# EAGLE design Controller Board V2.1 (EAGLE 9.6.2)

## Sheet 1 of 7: Fisnar Headers
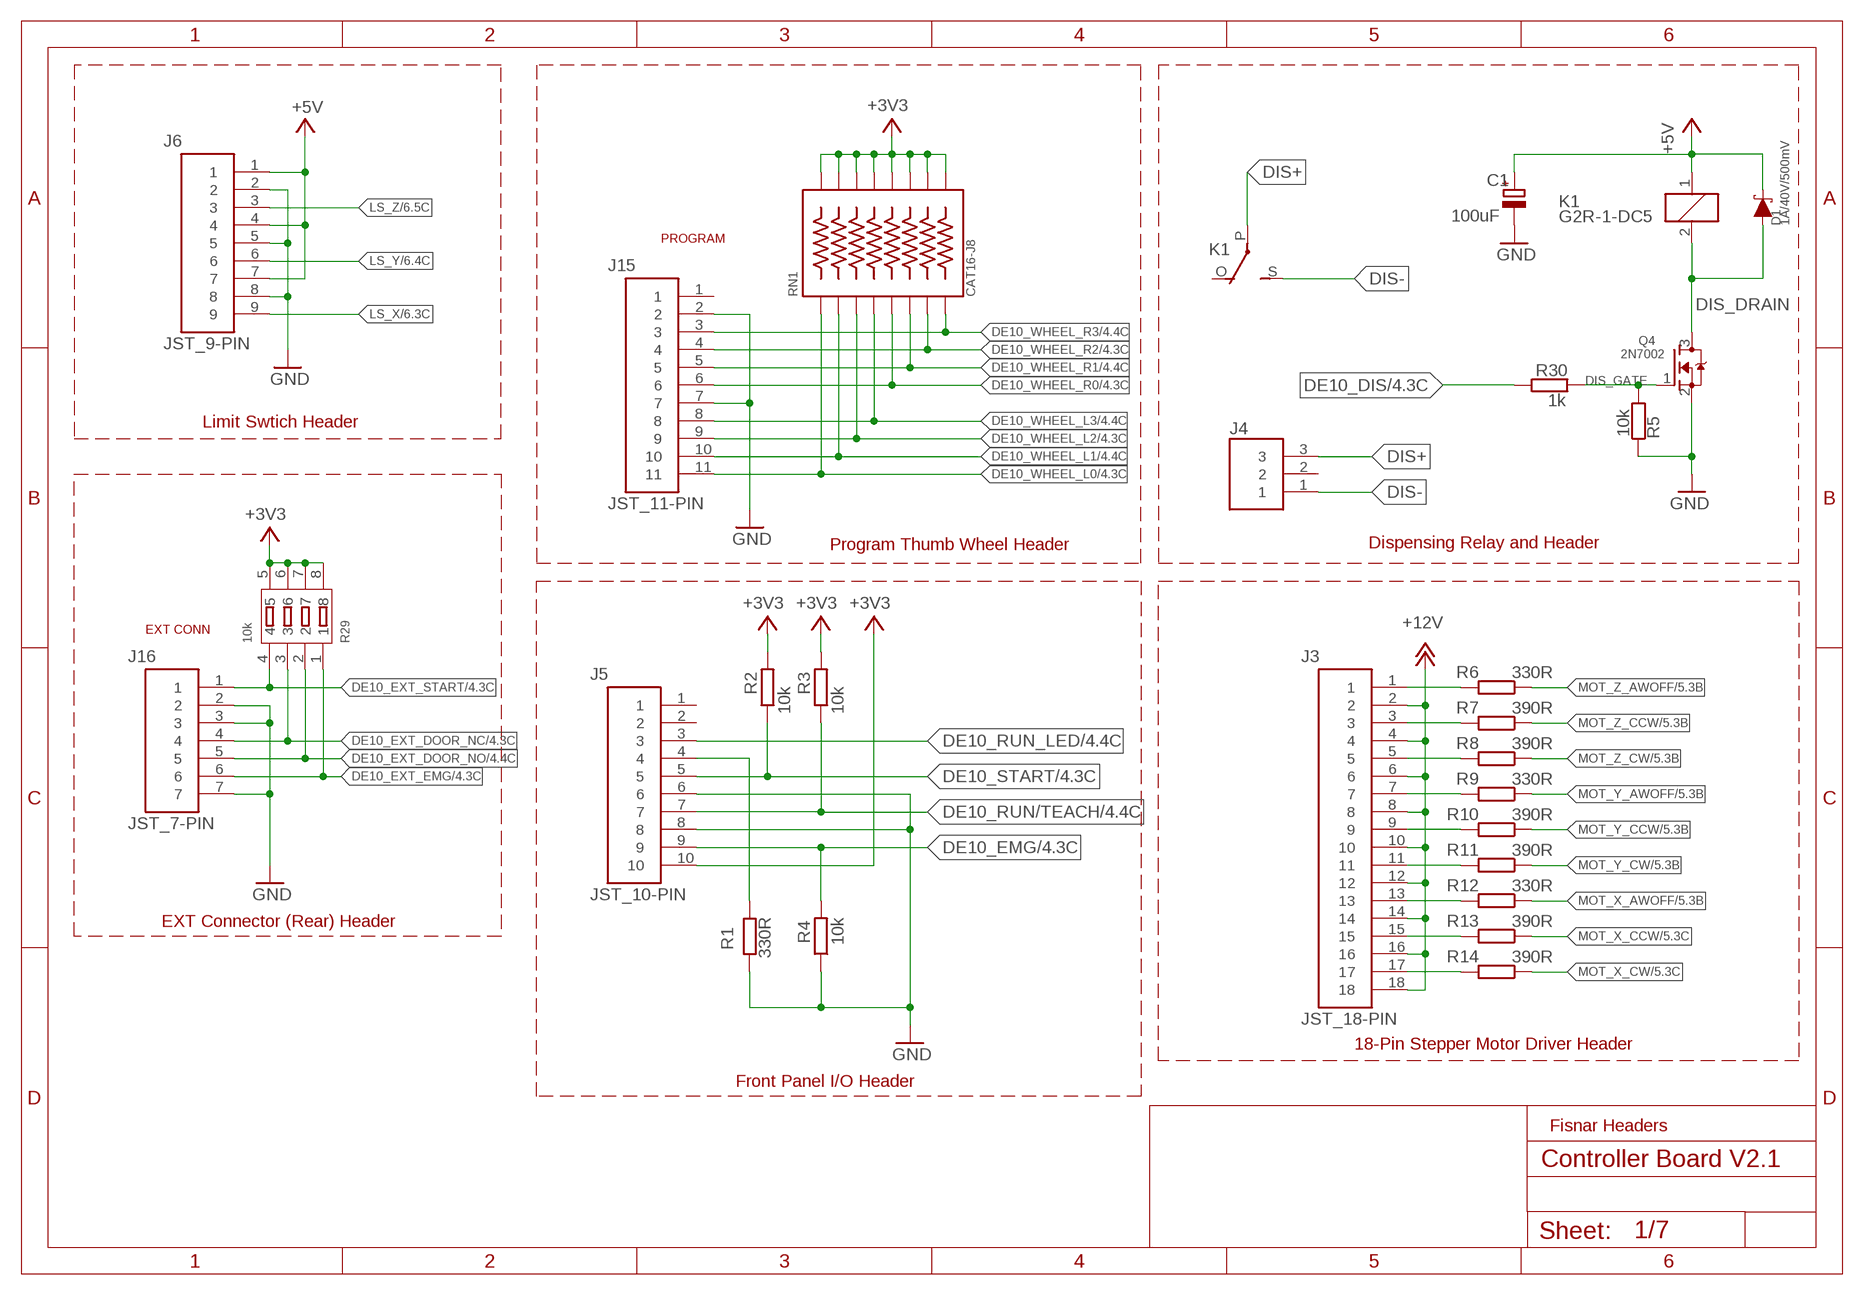
[diagram p0: schematic, sheet 1]

### Parts
C1  100uF  CPOL-EU153CLV-0810  [153CLV-0810]
D1  1A/40V/500mV  DIODE-SCHOTTKY-SS14  [SMA-DIODE]
J3  JST_18-PIN  [JST_18-PIN]
J4  JST_3-PIN  [JST_3-PIN]
J5  JST_10-PIN  [JST_10-PIN]
J6  JST_9-PIN  [JST_9-PIN]
J15  JST_11-PIN  [JST_11-PIN]
J16  JST_7-PIN  [JST_7-PIN]
K1  G2R-1-DC5  G2R  [G2R]
Q4  2N7002  MOSFET-NREFLOW  [SOT23]
R1  330R  R-EU_R0805  [R0805]
R2  10k  R-EU_R0805  [R0805]
R3  10k  R-EU_R0805  [R0805]
R4  10k  R-EU_R0805  [R0805]
R5  10k  R-EU_R0805  [R0805]
R6  330R  R-EU_R0805  [R0805]
R7  390R  R-EU_R0805  [R0805]
R8  390R  R-EU_R0805  [R0805]
R9  330R  R-EU_R0805  [R0805]
R10  390R  R-EU_R0805  [R0805]
R11  390R  R-EU_R0805  [R0805]
R12  330R  R-EU_R0805  [R0805]
R13  390R  R-EU_R0805  [R0805]
R14  390R  R-EU_R0805  [R0805]
R29  10k  SMD-RES-ARRAY-1K-4R(RA1206-8)  [RA1206-8]
R30  1k  R-EU_R0805  [R0805]
RN1  CAT16-J8  [RN8]

### Nets
+3V3: J5.10 R2.2 R3.2 R29.5 R29.6 R29.7 R29.8 RN1.2 RN1.4 RN1.6 RN1.8 RN1.10 RN1.12 RN1.14 RN1.16 ; also sheet 2,3,4,6
+5V: C1.+ D1.C J6.1 J6.4 J6.7 K1.1 ; also sheet 2,3,4,6
+12V: J3.2 J3.4 J3.6 J3.8 J3.10 J3.12 J3.14 J3.16 J3.18 ; also sheet 3,4,5,7
DE10_DIS: R30.2 ; also sheet 4
DE10_EMG: J5.9 R4.2 ; also sheet 4
DE10_EXT_DOOR_NC: J16.4 R29.3 ; also sheet 4
DE10_EXT_DOOR_NO: J16.5 R29.2 ; also sheet 4
DE10_EXT_EMG: J16.6 R29.1 ; also sheet 4
DE10_EXT_START: J16.1 R29.4 ; also sheet 4
DE10_RUN/TEACH: J5.7 R3.1 ; also sheet 4
DE10_RUN_LED: J5.3 ; also sheet 4
DE10_START: J5.5 R2.1 ; also sheet 4
DE10_WHEEL_L0: J15.11 RN1.1 ; also sheet 4
DE10_WHEEL_L1: J15.10 RN1.3 ; also sheet 4
DE10_WHEEL_L2: J15.9 RN1.5 ; also sheet 4
DE10_WHEEL_L3: J15.8 RN1.7 ; also sheet 4
DE10_WHEEL_R0: J15.6 RN1.9 ; also sheet 4
DE10_WHEEL_R1: J15.5 RN1.11 ; also sheet 4
DE10_WHEEL_R2: J15.4 RN1.13 ; also sheet 4
DE10_WHEEL_R3: J15.3 RN1.15 ; also sheet 4
DIS+: J4.3 K1.P(2:P)
DIS-: J4.1 K1.S(2:S)
DIS_DRAIN: D1.A K1.2 Q4.3(D)
DIS_GATE: Q4.1(G) R5.2 R30.1
GND: C1.- J5.6 J5.8 J6.2 J6.5 J6.8 J15.2 J15.7 J16.2 J16.3 J16.7 Q4.2(S) R1.2 R4.1 R5.1 ; also sheet 2,3,4,5,7
LS_X: J6.9 ; also sheet 6
LS_Y: J6.6 ; also sheet 6
LS_Z: J6.3 ; also sheet 6
MOT_X_AWOFF: R12.1 ; also sheet 5
MOT_X_CCW: R13.1 ; also sheet 5
MOT_X_CW: R14.1 ; also sheet 5
MOT_Y_AWOFF: R9.1 ; also sheet 5
MOT_Y_CCW: R10.1 ; also sheet 5
MOT_Y_CW: R11.1 ; also sheet 5
MOT_Z_AWOFF: R6.1 ; also sheet 5
MOT_Z_CCW: R7.1 ; also sheet 5
MOT_Z_CW: R8.1 ; also sheet 5
RUN_LED_RES: J5.4 R1.1
X_AWOFF_NEG: J3.13 R12.2
X_CCW_NEG: J3.15 R13.2
X_CW_NEG: J3.17 R14.2
Y_AWOFF_NEG: J3.7 R9.2
Y_CCW_NEG: J3.9 R10.2
Y_CW_NEG: J3.11 R11.2
Z_AWOFF_NEG: J3.1 R6.2
Z_CCW_NEG: J3.3 R7.2
Z_CW_NEG: J3.5 R8.2
Unconnected: J4.2 J5.1 J5.2 J15.1 K1.O(2:O)

### Notes on the sheet
- PROGRAM
- Limit Swtich Header
- Program Thumb Wheel Header | Dispensing Relay and Header
- EXT CONN
- EXT Connector (Rear) Header
- 18-Pin Stepper Motor Driver Header
- Front Panel I/O Header
- Fisnar Headers

## Sheet 2 of 7: SBC Connectors
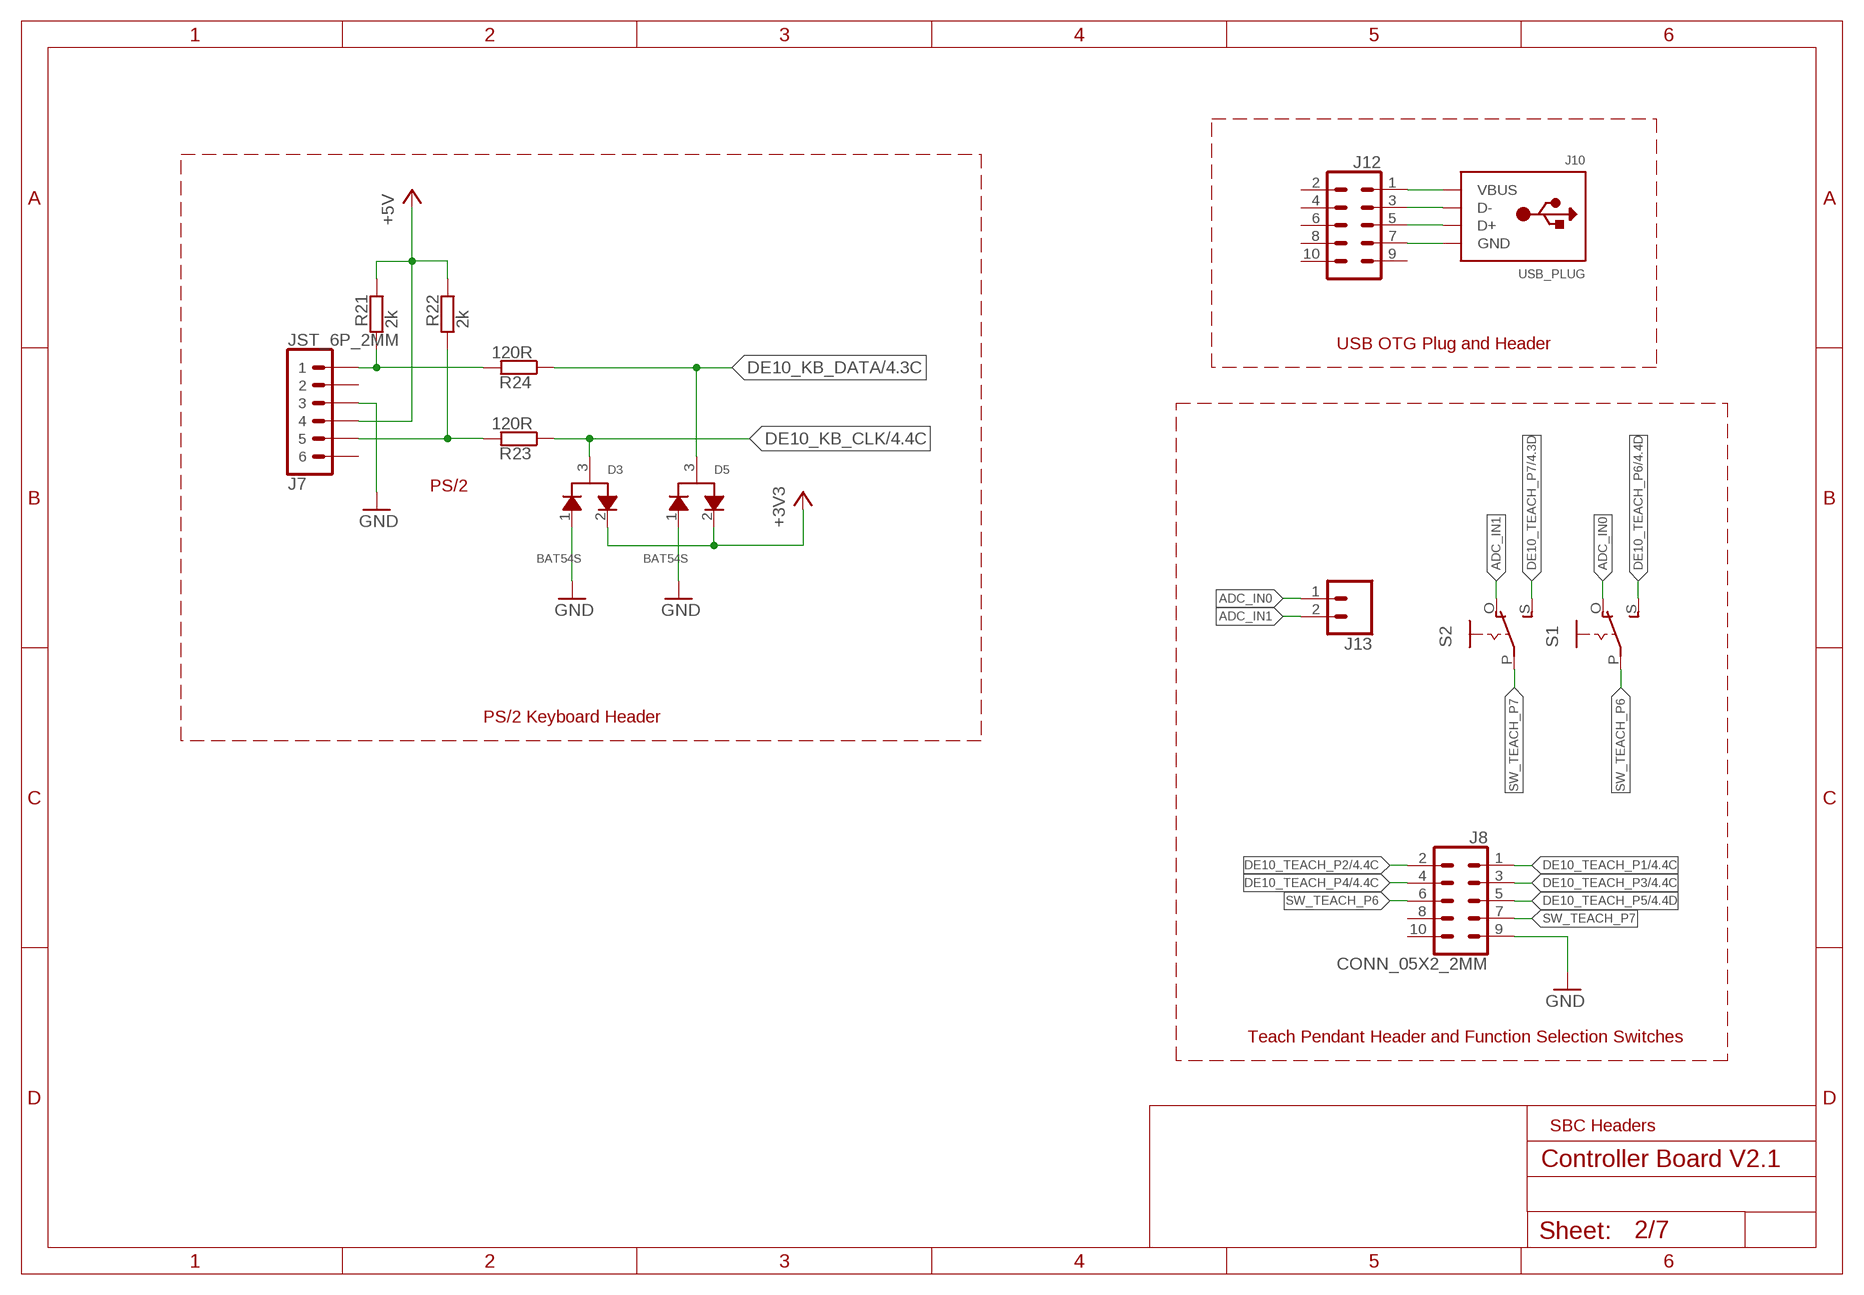
[diagram p1: schematic, sheet 2]

### Parts
D3  BAT54S  [SOT23]
D5  BAT54S  [SOT23]
J7  JST_6P_2MM  [JST_6P_2MM]
J8  CONN_05X2_2MM  [2X5-SHROUDED-2MM]
J10  USB_PLUG  [USB_PLUG]
J12  CONN_05X2PTH  [2X5]
J13  CONN_02  [1X02]
R21  2k  R-EU_R0805  [R0805]
R22  2k  R-EU_R0805  [R0805]
R23  120R  R-EU_R0805  [R0805]
R24  120R  R-EU_R0805  [R0805]
S1  EG1218S  [EG1218]
S2  EG1218S  [EG1218]

### Nets
+3V3: D3.2 D5.2 ; also sheet 1,3,4,6
+5V: J7.P$4 R21.2 R22.2 ; also sheet 1,3,4,6
ADC_IN0: J13.1 S1.O
ADC_IN1: J13.2 S2.O
DE10_KB_CLK: D3.3 R23.1 ; also sheet 4
DE10_KB_DATA: D5.3 R24.1 ; also sheet 4
DE10_TEACH_P1: J8.1 ; also sheet 4
DE10_TEACH_P2: J8.2 ; also sheet 4
DE10_TEACH_P3: J8.3 ; also sheet 4
DE10_TEACH_P4: J8.4 ; also sheet 4
DE10_TEACH_P5: J8.5 ; also sheet 4
DE10_TEACH_P6: S1.S ; also sheet 4
DE10_TEACH_P7: S2.S ; also sheet 4
GND: D3.1 D5.1 J7.P$3 J8.9 ; also sheet 1,3,4,5,7
OTG_D+: J10.D+ J12.5
OTG_D-: J10.D- J12.3
OTG_GND: J10.USB_GND(GND) J12.7
OTG_VBUS: J10.VBUS J12.1
PS2_KB_CLK: J7.P$5 R22.1 R23.2
PS2_KB_DATA: J7.P$1 R21.1 R24.2
SW_TEACH_P6: J8.6 S1.P
SW_TEACH_P7: J8.7 S2.P
Unconnected: J7.P$2 J7.P$6 J8.8 J8.10 J12.2 J12.4 J12.6 J12.8 J12.9 J12.10

### Notes on the sheet
- USB OTG Plug and Header
- PS/2
- PS/2 Keyboard Header
- Teach Pendant Header and Function Selection Switches
- SBC Headers

## Sheet 3 of 7: Rear I/O
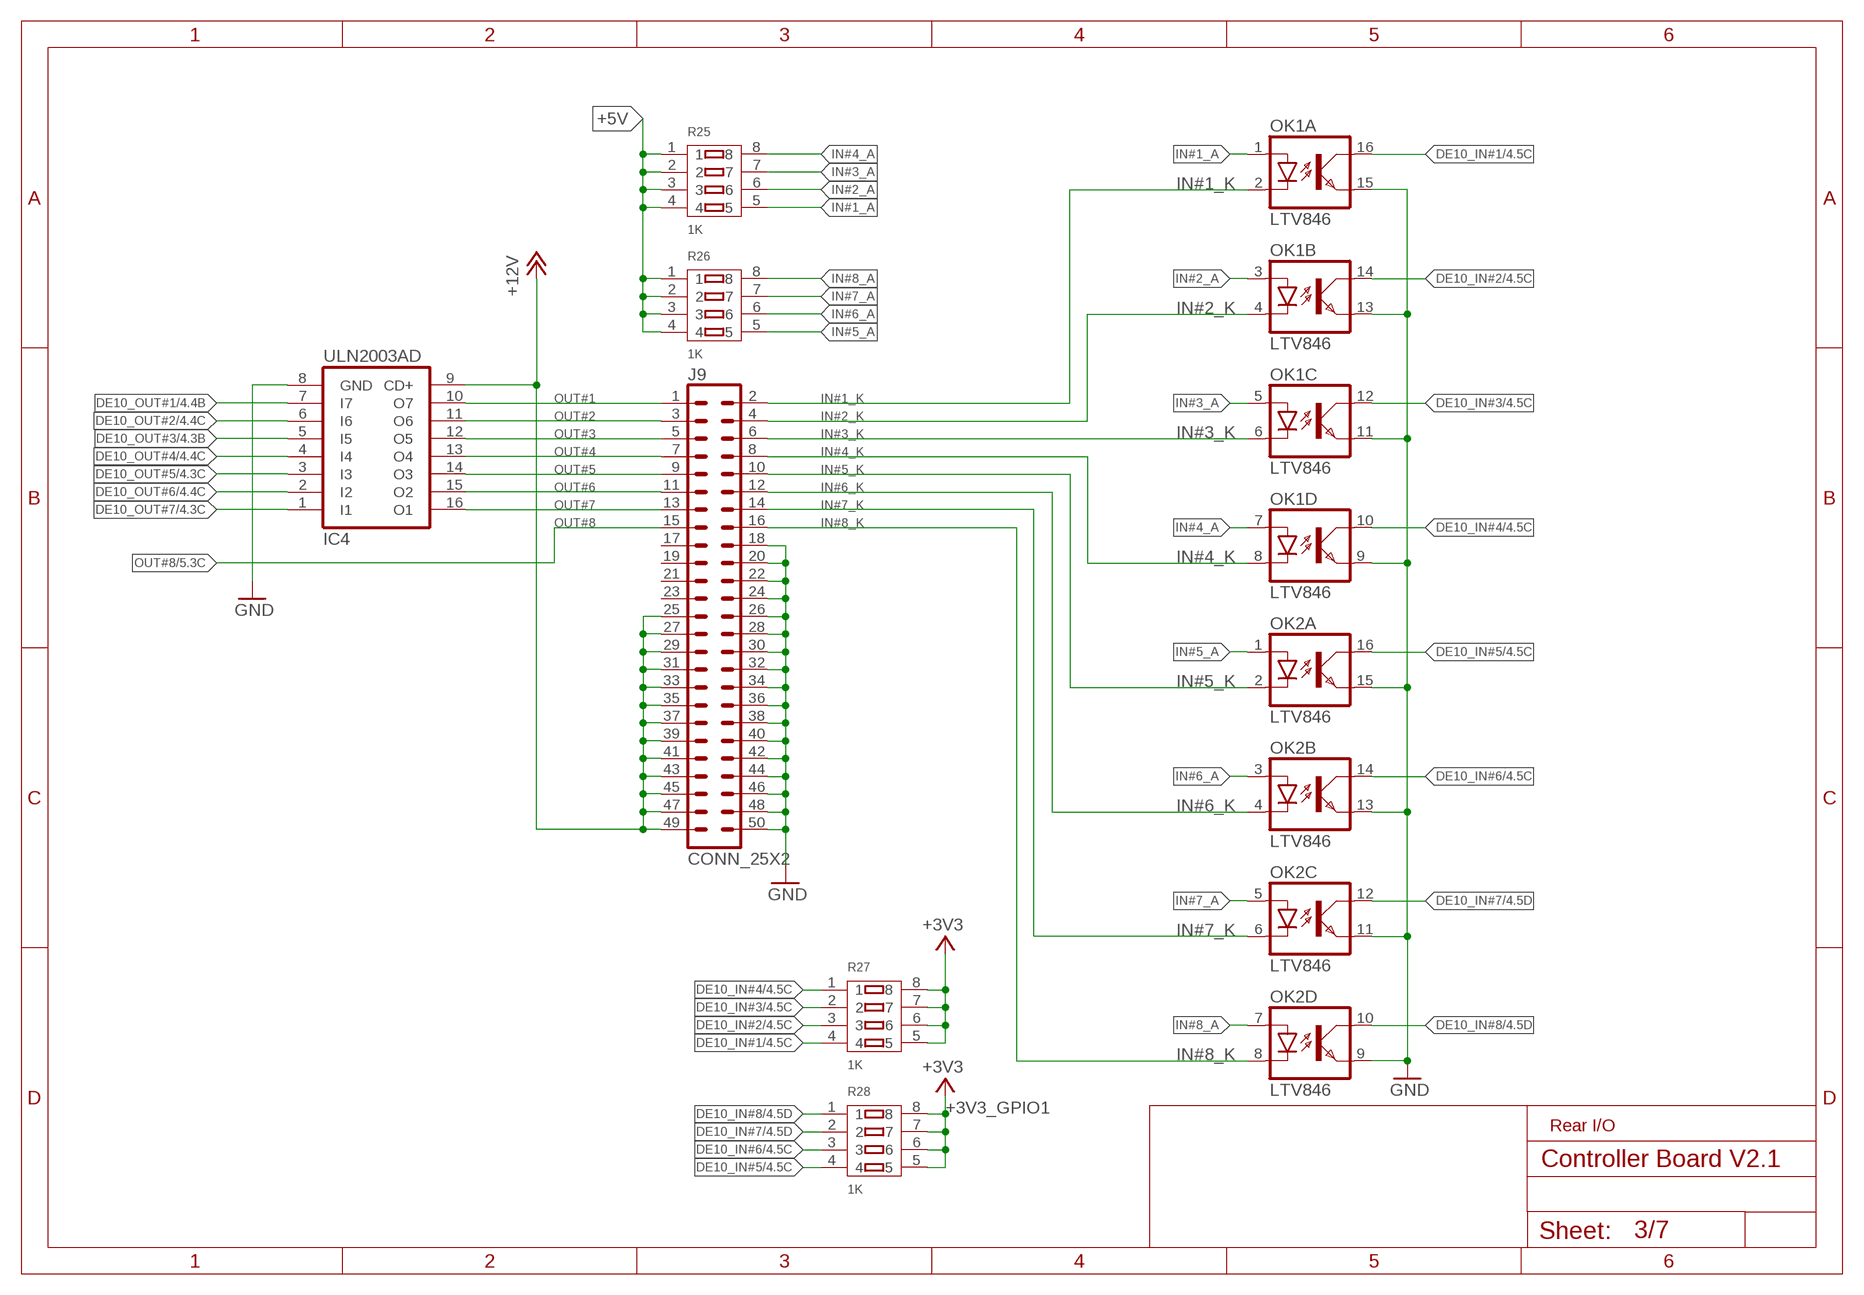
[diagram p2: schematic, sheet 3]

### Parts
IC4  ULN2003AD  [SO16]
J9  CONN_25X2  [2X25]
OK1  LTV846  [DIL8-SMD]
OK2  LTV846  [DIL8-SMD]
R25  1K  SMD-RES-ARRAY-1K-4R(RA1206-8)  [RA1206-8]
R26  1K  SMD-RES-ARRAY-1K-4R(RA1206-8)  [RA1206-8]
R27  1K  SMD-RES-ARRAY-1K-4R(RA1206-8)  [RA1206-8]
R28  1K  SMD-RES-ARRAY-1K-4R(RA1206-8)  [RA1206-8]

### Nets
+3V3: R27.5 R27.6 R27.7 R27.8 ; also sheet 1,2,4,6
+3V3_GPIO1: R28.5 R28.6 R28.7 R28.8 ; supply symbol labelled +3V3 ; also sheet 4,7
+5V: R25.1 R25.2 R25.3 R25.4 R26.1 R26.2 R26.3 R26.4 ; also sheet 1,2,4,6
+12V: IC4.9(CD+) J9.25 J9.27 J9.29 J9.31 J9.33 J9.35 J9.37 J9.39 J9.41 J9.43 J9.45 J9.47 J9.49 ; also sheet 1,4,5,7
DE10_IN#1: OK1.16(A:COL) R27.4 ; also sheet 4
DE10_IN#2: OK1.14(B:COL) R27.3 ; also sheet 4
DE10_IN#3: OK1.12(C:COL) R27.2 ; also sheet 4
DE10_IN#4: OK1.10(D:COL) R27.1 ; also sheet 4
DE10_IN#5: OK2.16(A:COL) R28.4 ; also sheet 4
DE10_IN#6: OK2.14(B:COL) R28.3 ; also sheet 4
DE10_IN#7: OK2.12(C:COL) R28.2 ; also sheet 4
DE10_IN#8: OK2.10(D:COL) R28.1 ; also sheet 4
DE10_OUT#1: IC4.7(I7) ; also sheet 4
DE10_OUT#2: IC4.6(I6) ; also sheet 4
DE10_OUT#3: IC4.5(I5) ; also sheet 4
DE10_OUT#4: IC4.4(I4) ; also sheet 4
DE10_OUT#5: IC4.3(I3) ; also sheet 4
DE10_OUT#6: IC4.2(I2) ; also sheet 4
DE10_OUT#7: IC4.1(I1) ; also sheet 4
GND: IC4.8(GND) J9.18 J9.20 J9.22 J9.24 J9.26 J9.28 J9.30 J9.32 J9.34 J9.36 J9.38 J9.40 J9.42 J9.44 J9.46 J9.48 J9.50 OK1.9(D:EMIT) OK1.11(C:EMIT) OK1.13(B:EMIT) OK1.15(A:EMIT) OK2.9(D:EMIT) OK2.11(C:EMIT) OK2.13(B:EMIT) OK2.15(A:EMIT) ; also sheet 1,2,4,5,7
IN#1_A: OK1.1(A:A) R25.5
IN#1_K: J9.2 OK1.2(A:C)
IN#2_A: OK1.3(B:A) R25.6
IN#2_K: J9.4 OK1.4(B:C)
IN#3_A: OK1.5(C:A) R25.7
IN#3_K: J9.6 OK1.6(C:C)
IN#4_A: OK1.7(D:A) R25.8
IN#4_K: J9.8 OK1.8(D:C)
IN#5_A: OK2.1(A:A) R26.5
IN#5_K: J9.10 OK2.2(A:C)
IN#6_A: OK2.3(B:A) R26.6
IN#6_K: J9.12 OK2.4(B:C)
IN#7_A: OK2.5(C:A) R26.7
IN#7_K: J9.14 OK2.6(C:C)
IN#8_A: OK2.7(D:A) R26.8
IN#8_K: J9.16 OK2.8(D:C)
OUT#1: IC4.10(O7) J9.1
OUT#2: IC4.11(O6) J9.3
OUT#3: IC4.12(O5) J9.5
OUT#4: IC4.13(O4) J9.7
OUT#5: IC4.14(O3) J9.9
OUT#6: IC4.15(O2) J9.11
OUT#7: IC4.16(O1) J9.13
OUT#8: J9.15 ; also sheet 5
Unconnected: J9.17 J9.19 J9.21 J9.23

### Notes on the sheet
- Rear I/O

## Sheet 4 of 7: DE10-Nano Connectors
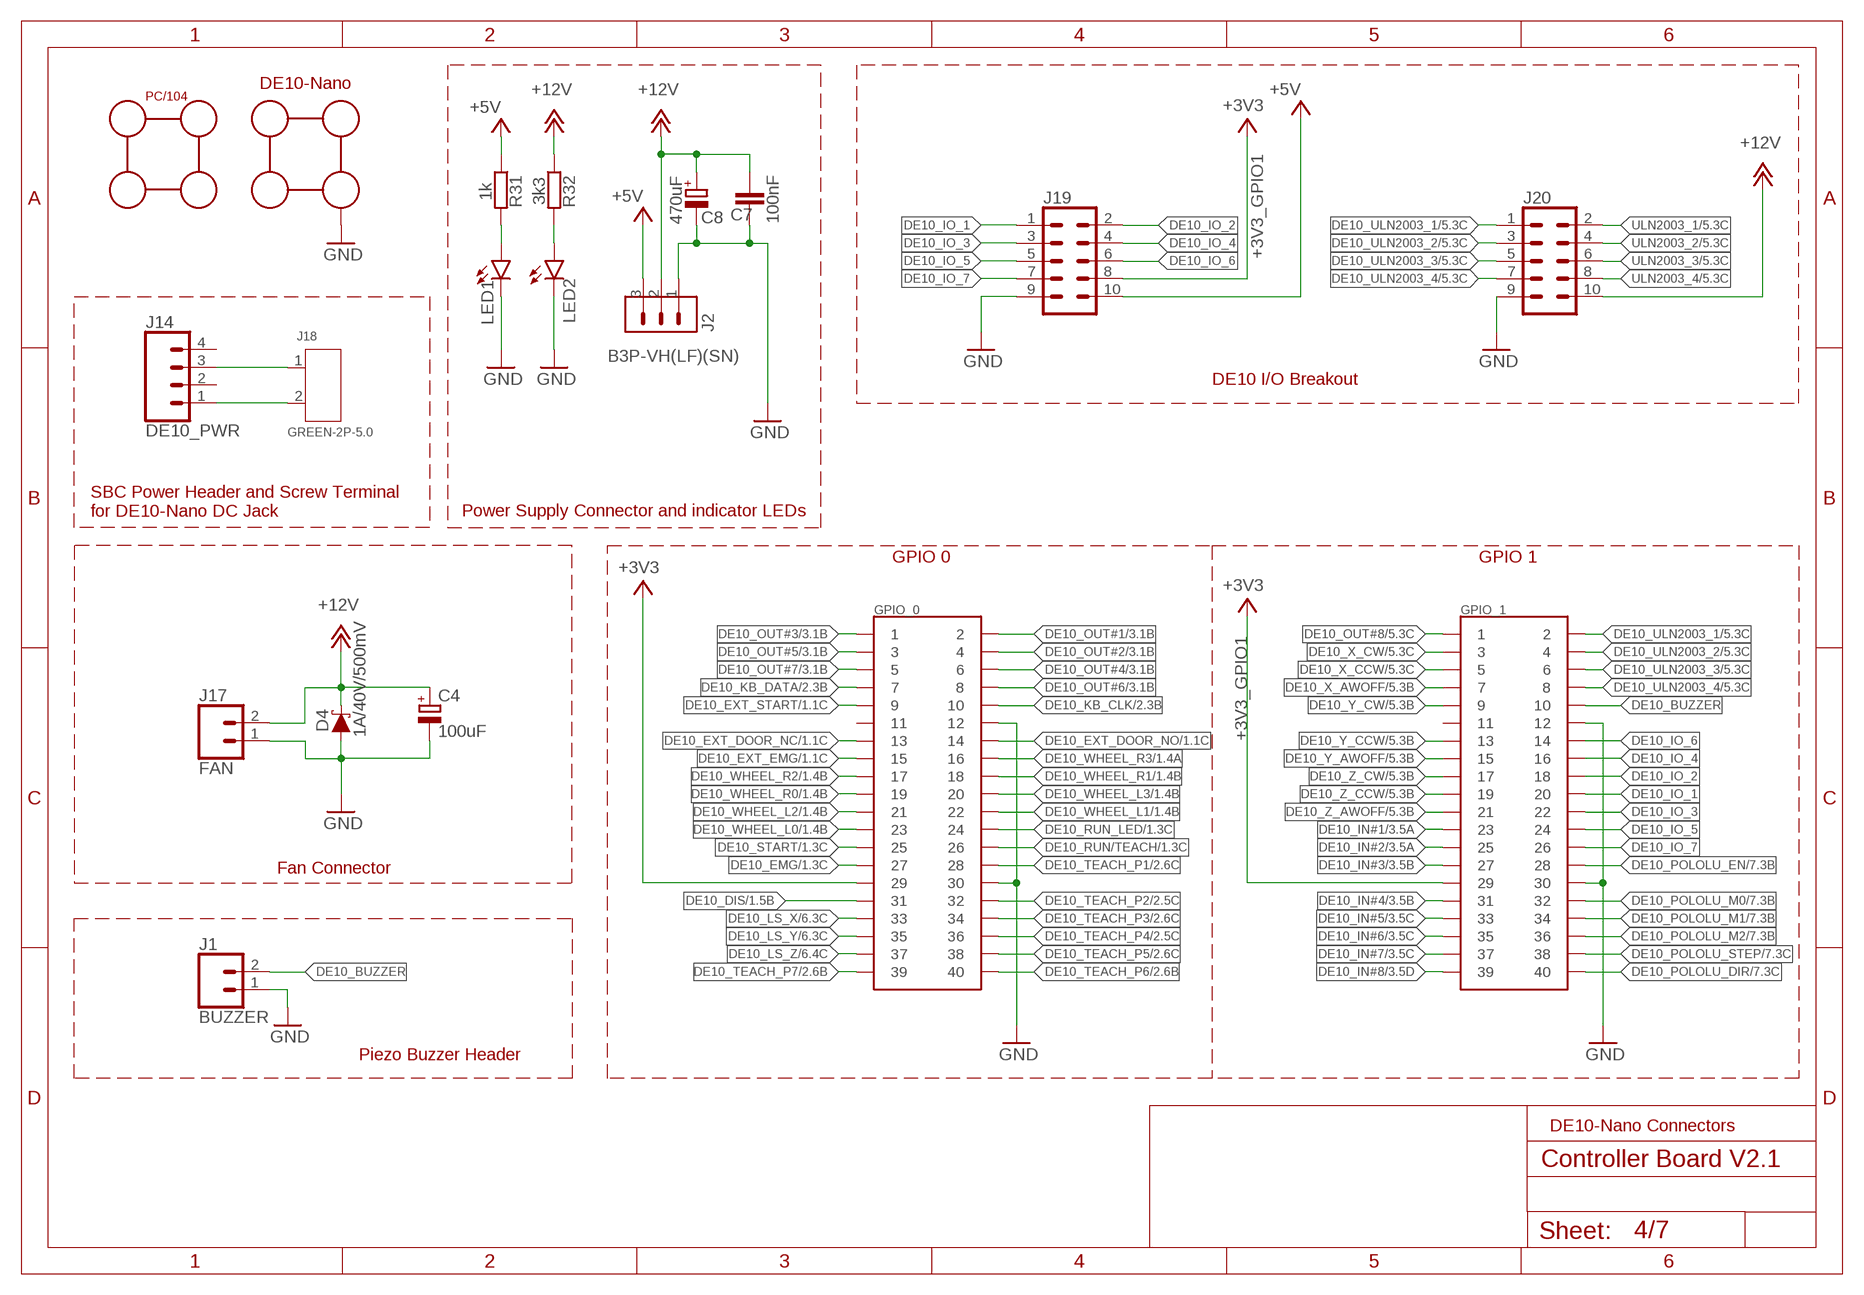
[diagram p3: schematic, sheet 4]

### Parts
C4  100uF  CPOL-EU153CLV-0810  [153CLV-0810]
C7  100nF  C-EUC0805  [C0805]
C8  470uF  CPOL-EU153CLV-0810  [153CLV-0810]
D4  1A/40V/500mV  DIODE-SCHOTTKY-SS14  [SMA-DIODE]
DE1  DE10_FOOTPRINT  [DE10_FOOTPRINT]
J1  BUZZER  CONN_02  [1X02]
J2  B3P-VH(LF)(SN)  [HDR-03]
J14  DE10_PWR  CONN_041X04_NO_SILK  [1X04_NO_SILK]
J17  FAN  CONN_02  [1X02]
J18  GREEN-2P-5.0  SCREW-TERMINAL-GREEN(2P-5.0)  [H2-5.0-10.5X8.0MM]
J19  CONN_05X2PTH  [2X5]
J20  CONN_05X2PTH  [2X5]
LED1  LEDCHIP-LED0805  [CHIP-LED0805]
LED2  LEDCHIP-LED0805  [CHIP-LED0805]
R31  1k  R-EU_R0805  [R0805]
R32  3k3  R-EU_R0805  [R0805]
U$1  PC104_FOOTPRINT  [PC104_FOOTPRINT]

### Nets
+3V3: DE1.GPIO_0_29 ; also sheet 1,2,3,6
+3V3_GPIO1: DE1.GPIO_1_29 J19.8 ; supply symbol labelled +3V3 ; also sheet 3,7
+5V: J2.3 J19.10 R31.1 ; also sheet 1,2,3,6
+12V: C4.+ C7.1 C8.+ D4.C J2.2 J17.2 J20.10 R32.1 ; also sheet 1,3,5,7
DE10_BUZZER: DE1.GPIO_1_10 J1.2
DE10_DCJACK_5V: J14.1 J18.2
DE10_DCJACK_GND: J14.3 J18.1
DE10_DIS: DE1.GPIO_0_31 ; also sheet 1
DE10_EMG: DE1.GPIO_0_27 ; also sheet 1
DE10_EXT_DOOR_NC: DE1.GPIO_0_13 ; also sheet 1
DE10_EXT_DOOR_NO: DE1.GPIO_0_14 ; also sheet 1
DE10_EXT_EMG: DE1.GPIO_0_15 ; also sheet 1
DE10_EXT_START: DE1.GPIO_0_9 ; also sheet 1
DE10_IN#1: DE1.GPIO_1_23 ; also sheet 3
DE10_IN#2: DE1.GPIO_1_25 ; also sheet 3
DE10_IN#3: DE1.GPIO_1_27 ; also sheet 3
DE10_IN#4: DE1.GPIO_1_31 ; also sheet 3
DE10_IN#5: DE1.GPIO_1_33 ; also sheet 3
DE10_IN#6: DE1.GPIO_1_35 ; also sheet 3
DE10_IN#7: DE1.GPIO_1_37 ; also sheet 3
DE10_IN#8: DE1.GPIO_1_39 ; also sheet 3
DE10_IO_1: DE1.GPIO_1_20 J19.1
DE10_IO_2: DE1.GPIO_1_18 J19.2
DE10_IO_3: DE1.GPIO_1_22 J19.3
DE10_IO_4: DE1.GPIO_1_16 J19.4
DE10_IO_5: DE1.GPIO_1_24 J19.5
DE10_IO_6: DE1.GPIO_1_14 J19.6
DE10_IO_7: DE1.GPIO_1_26 J19.7
DE10_KB_CLK: DE1.GPIO_0_10 ; also sheet 2
DE10_KB_DATA: DE1.GPIO_0_7 ; also sheet 2
DE10_LS_X: DE1.GPIO_0_33 ; also sheet 6
DE10_LS_Y: DE1.GPIO_0_35 ; also sheet 6
DE10_LS_Z: DE1.GPIO_0_37 ; also sheet 6
DE10_OUT#1: DE1.GPIO_0_2 ; also sheet 3
DE10_OUT#2: DE1.GPIO_0_4 ; also sheet 3
DE10_OUT#3: DE1.GPIO_0_1 ; also sheet 3
DE10_OUT#4: DE1.GPIO_0_6 ; also sheet 3
DE10_OUT#5: DE1.GPIO_0_3 ; also sheet 3
DE10_OUT#6: DE1.GPIO_0_8 ; also sheet 3
DE10_OUT#7: DE1.GPIO_0_5 ; also sheet 3
DE10_OUT#8: DE1.GPIO_1_1 ; also sheet 5
DE10_POLOLU_DIR: DE1.GPIO_1_40 ; also sheet 7
DE10_POLOLU_EN: DE1.GPIO_1_28 ; also sheet 7
DE10_POLOLU_M0: DE1.GPIO_1_32 ; also sheet 7
DE10_POLOLU_M1: DE1.GPIO_1_34 ; also sheet 7
DE10_POLOLU_M2: DE1.GPIO_1_36 ; also sheet 7
DE10_POLOLU_STEP: DE1.GPIO_1_38 ; also sheet 7
DE10_RUN/TEACH: DE1.GPIO_0_26 ; also sheet 1
DE10_RUN_LED: DE1.GPIO_0_24 ; also sheet 1
DE10_START: DE1.GPIO_0_25 ; also sheet 1
DE10_TEACH_P1: DE1.GPIO_0_28 ; also sheet 2
DE10_TEACH_P2: DE1.GPIO_0_32 ; also sheet 2
DE10_TEACH_P3: DE1.GPIO_0_34 ; also sheet 2
DE10_TEACH_P4: DE1.GPIO_0_36 ; also sheet 2
DE10_TEACH_P5: DE1.GPIO_0_38 ; also sheet 2
DE10_TEACH_P6: DE1.GPIO_0_40 ; also sheet 2
DE10_TEACH_P7: DE1.GPIO_0_39 ; also sheet 2
DE10_ULN2003_1: DE1.GPIO_1_2 J20.1 ; also sheet 5
DE10_ULN2003_2: DE1.GPIO_1_4 J20.3 ; also sheet 5
DE10_ULN2003_3: DE1.GPIO_1_6 J20.5 ; also sheet 5
DE10_ULN2003_4: DE1.GPIO_1_8 J20.7 ; also sheet 5
DE10_WHEEL_L0: DE1.GPIO_0_23 ; also sheet 1
DE10_WHEEL_L1: DE1.GPIO_0_22 ; also sheet 1
DE10_WHEEL_L2: DE1.GPIO_0_21 ; also sheet 1
DE10_WHEEL_L3: DE1.GPIO_0_20 ; also sheet 1
DE10_WHEEL_R0: DE1.GPIO_0_19 ; also sheet 1
DE10_WHEEL_R1: DE1.GPIO_0_18 ; also sheet 1
DE10_WHEEL_R2: DE1.GPIO_0_17 ; also sheet 1
DE10_WHEEL_R3: DE1.GPIO_0_16 ; also sheet 1
DE10_X_AWOFF: DE1.GPIO_1_7 ; also sheet 5
DE10_X_CCW: DE1.GPIO_1_5 ; also sheet 5
DE10_X_CW: DE1.GPIO_1_3 ; also sheet 5
DE10_Y_AWOFF: DE1.GPIO_1_15 ; also sheet 5
DE10_Y_CCW: DE1.GPIO_1_13 ; also sheet 5
DE10_Y_CW: DE1.GPIO_1_9 ; also sheet 5
DE10_Z_AWOFF: DE1.GPIO_1_21 ; also sheet 5
DE10_Z_CCW: DE1.GPIO_1_19 ; also sheet 5
DE10_Z_CW: DE1.GPIO_1_17 ; also sheet 5
GND: C4.- C7.2 C8.- D4.A DE1.GPIO_0_12 DE1.GPIO_0_30 DE1.GPIO_1_12 DE1.GPIO_1_30 DE1.P$1 DE1.P$2 DE1.P$3 DE1.P$4 J1.1 J2.1 J17.1 J19.9 J20.9 LED1.C LED2.C ; also sheet 1,2,3,5,7
N$1: LED1.A R31.2
N$2: LED2.A R32.2
ULN2003_1: J20.2 ; also sheet 5
ULN2003_2: J20.4 ; also sheet 5
ULN2003_3: J20.6 ; also sheet 5
ULN2003_4: J20.8 ; also sheet 5
Unconnected: DE1.GPIO_0_11 DE1.GPIO_1_11 J14.2 J14.4

### Notes on the sheet
- DE10 I/O Breakout
- SBC Power Header and Screw Terminal
  for DE10-Nano DC Jack
- Power Supply Connector and indicator LEDs
- GPIO 0 | GPIO 1
- Fan Connector
- Piezo Buzzer Header
- DE10-Nano Connectors

## Sheet 5 of 7
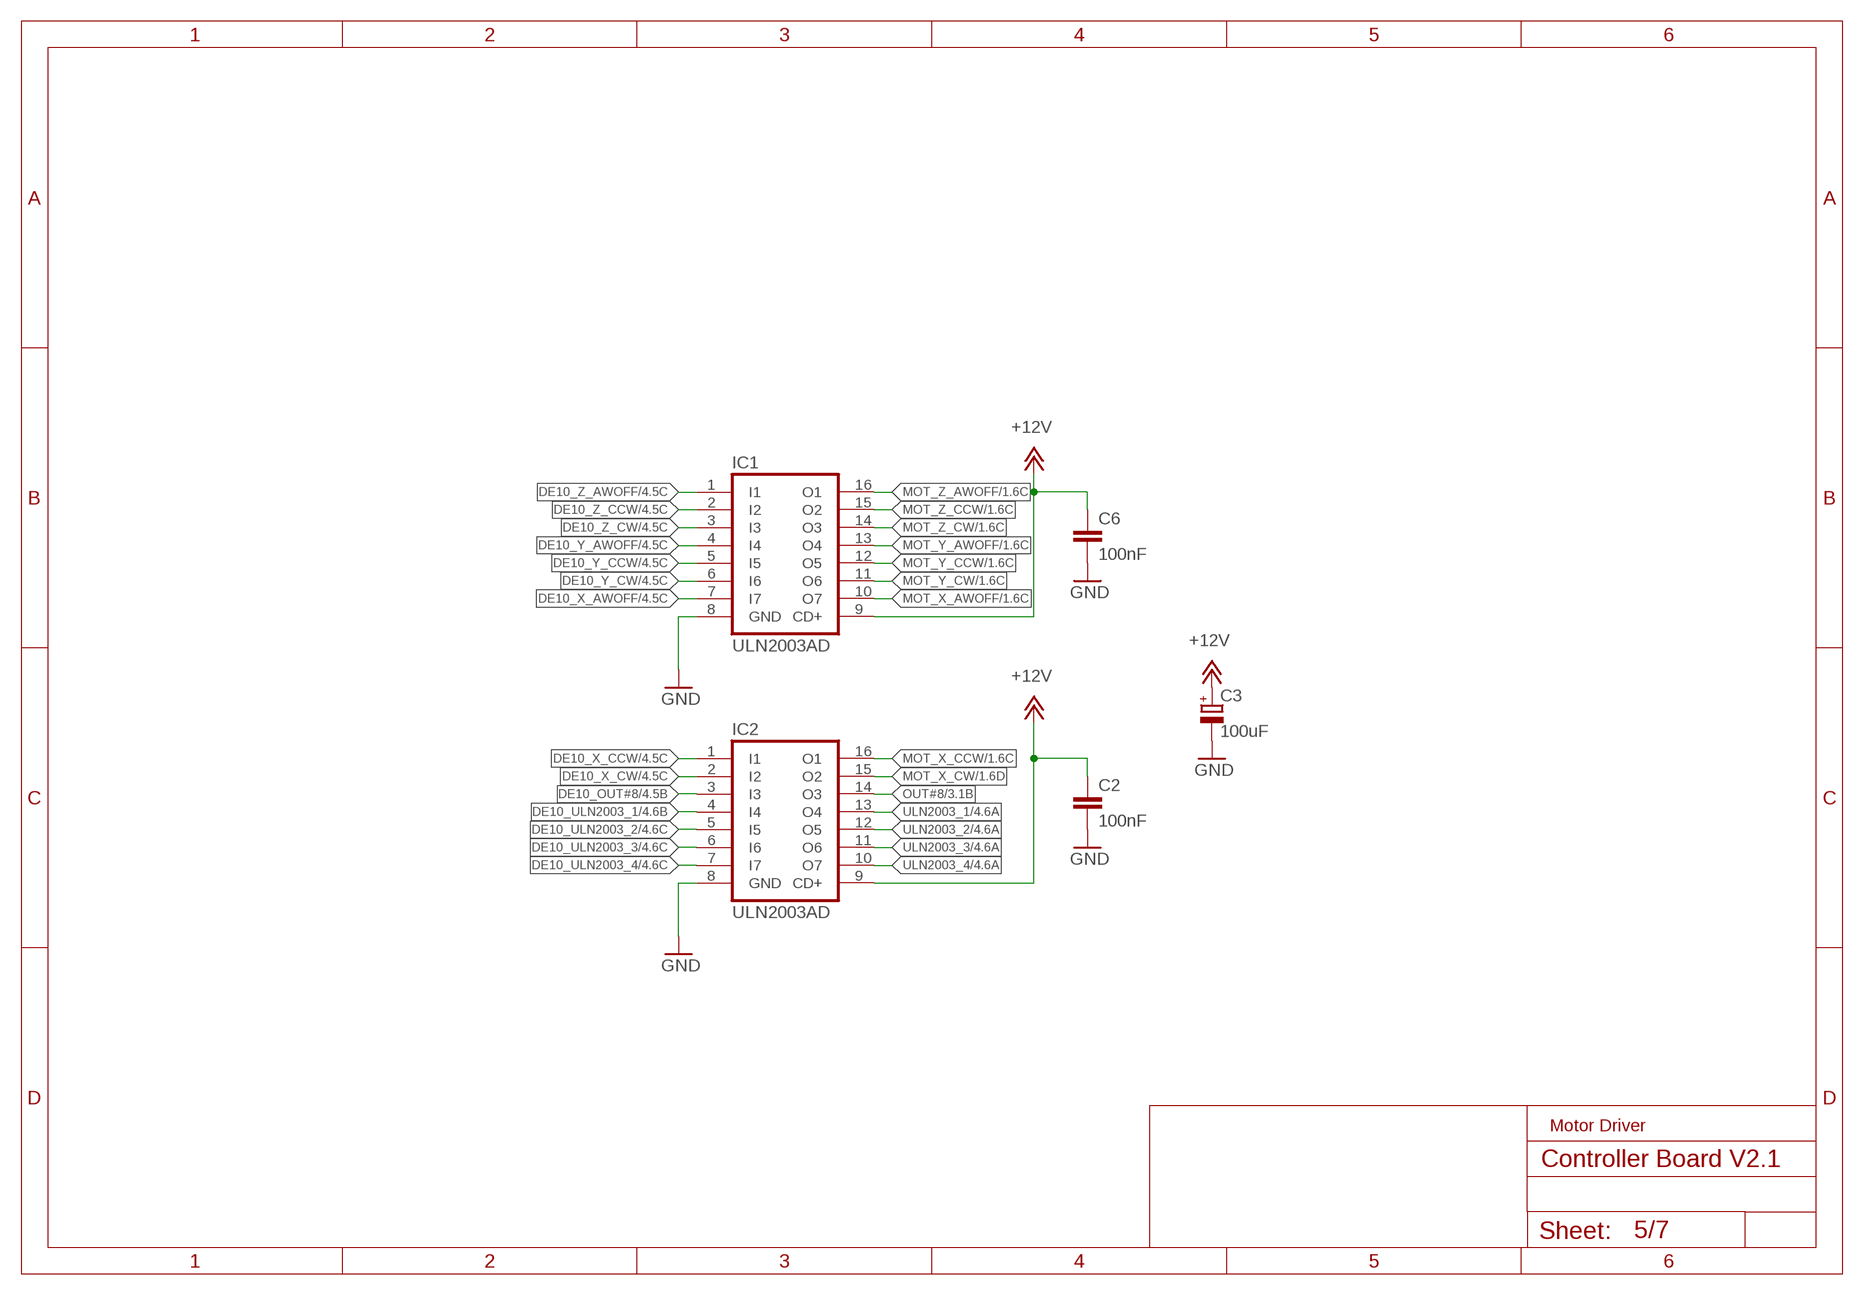
[diagram p4: schematic, sheet 5]

### Parts
C2  100nF  C-EUC0805  [C0805]
C3  100uF  CPOL-EU153CLV-0810  [153CLV-0810]
C6  100nF  C-EUC0805  [C0805]
IC1  ULN2003AD  [SO16]
IC2  ULN2003AD  [SO16]

### Nets
+12V: C2.1 C3.+ C6.1 IC1.9(CD+) IC2.9(CD+) ; also sheet 1,3,4,7
DE10_OUT#8: IC2.3(I3) ; also sheet 4
DE10_ULN2003_1: IC2.4(I4) ; also sheet 4
DE10_ULN2003_2: IC2.5(I5) ; also sheet 4
DE10_ULN2003_3: IC2.6(I6) ; also sheet 4
DE10_ULN2003_4: IC2.7(I7) ; also sheet 4
DE10_X_AWOFF: IC1.7(I7) ; also sheet 4
DE10_X_CCW: IC2.1(I1) ; also sheet 4
DE10_X_CW: IC2.2(I2) ; also sheet 4
DE10_Y_AWOFF: IC1.4(I4) ; also sheet 4
DE10_Y_CCW: IC1.5(I5) ; also sheet 4
DE10_Y_CW: IC1.6(I6) ; also sheet 4
DE10_Z_AWOFF: IC1.1(I1) ; also sheet 4
DE10_Z_CCW: IC1.2(I2) ; also sheet 4
DE10_Z_CW: IC1.3(I3) ; also sheet 4
GND: C2.2 C3.- C6.2 IC1.8(GND) IC2.8(GND) ; also sheet 1,2,3,4,7
MOT_X_AWOFF: IC1.10(O7) ; also sheet 1
MOT_X_CCW: IC2.16(O1) ; also sheet 1
MOT_X_CW: IC2.15(O2) ; also sheet 1
MOT_Y_AWOFF: IC1.13(O4) ; also sheet 1
MOT_Y_CCW: IC1.12(O5) ; also sheet 1
MOT_Y_CW: IC1.11(O6) ; also sheet 1
MOT_Z_AWOFF: IC1.16(O1) ; also sheet 1
MOT_Z_CCW: IC1.15(O2) ; also sheet 1
MOT_Z_CW: IC1.14(O3) ; also sheet 1
OUT#8: IC2.14(O3) ; also sheet 3
ULN2003_1: IC2.13(O4) ; also sheet 4
ULN2003_2: IC2.12(O5) ; also sheet 4
ULN2003_3: IC2.11(O6) ; also sheet 4
ULN2003_4: IC2.10(O7) ; also sheet 4

### Notes on the sheet
- Motor Driver

## Sheet 6 of 7: Limit Switch Level Shifting
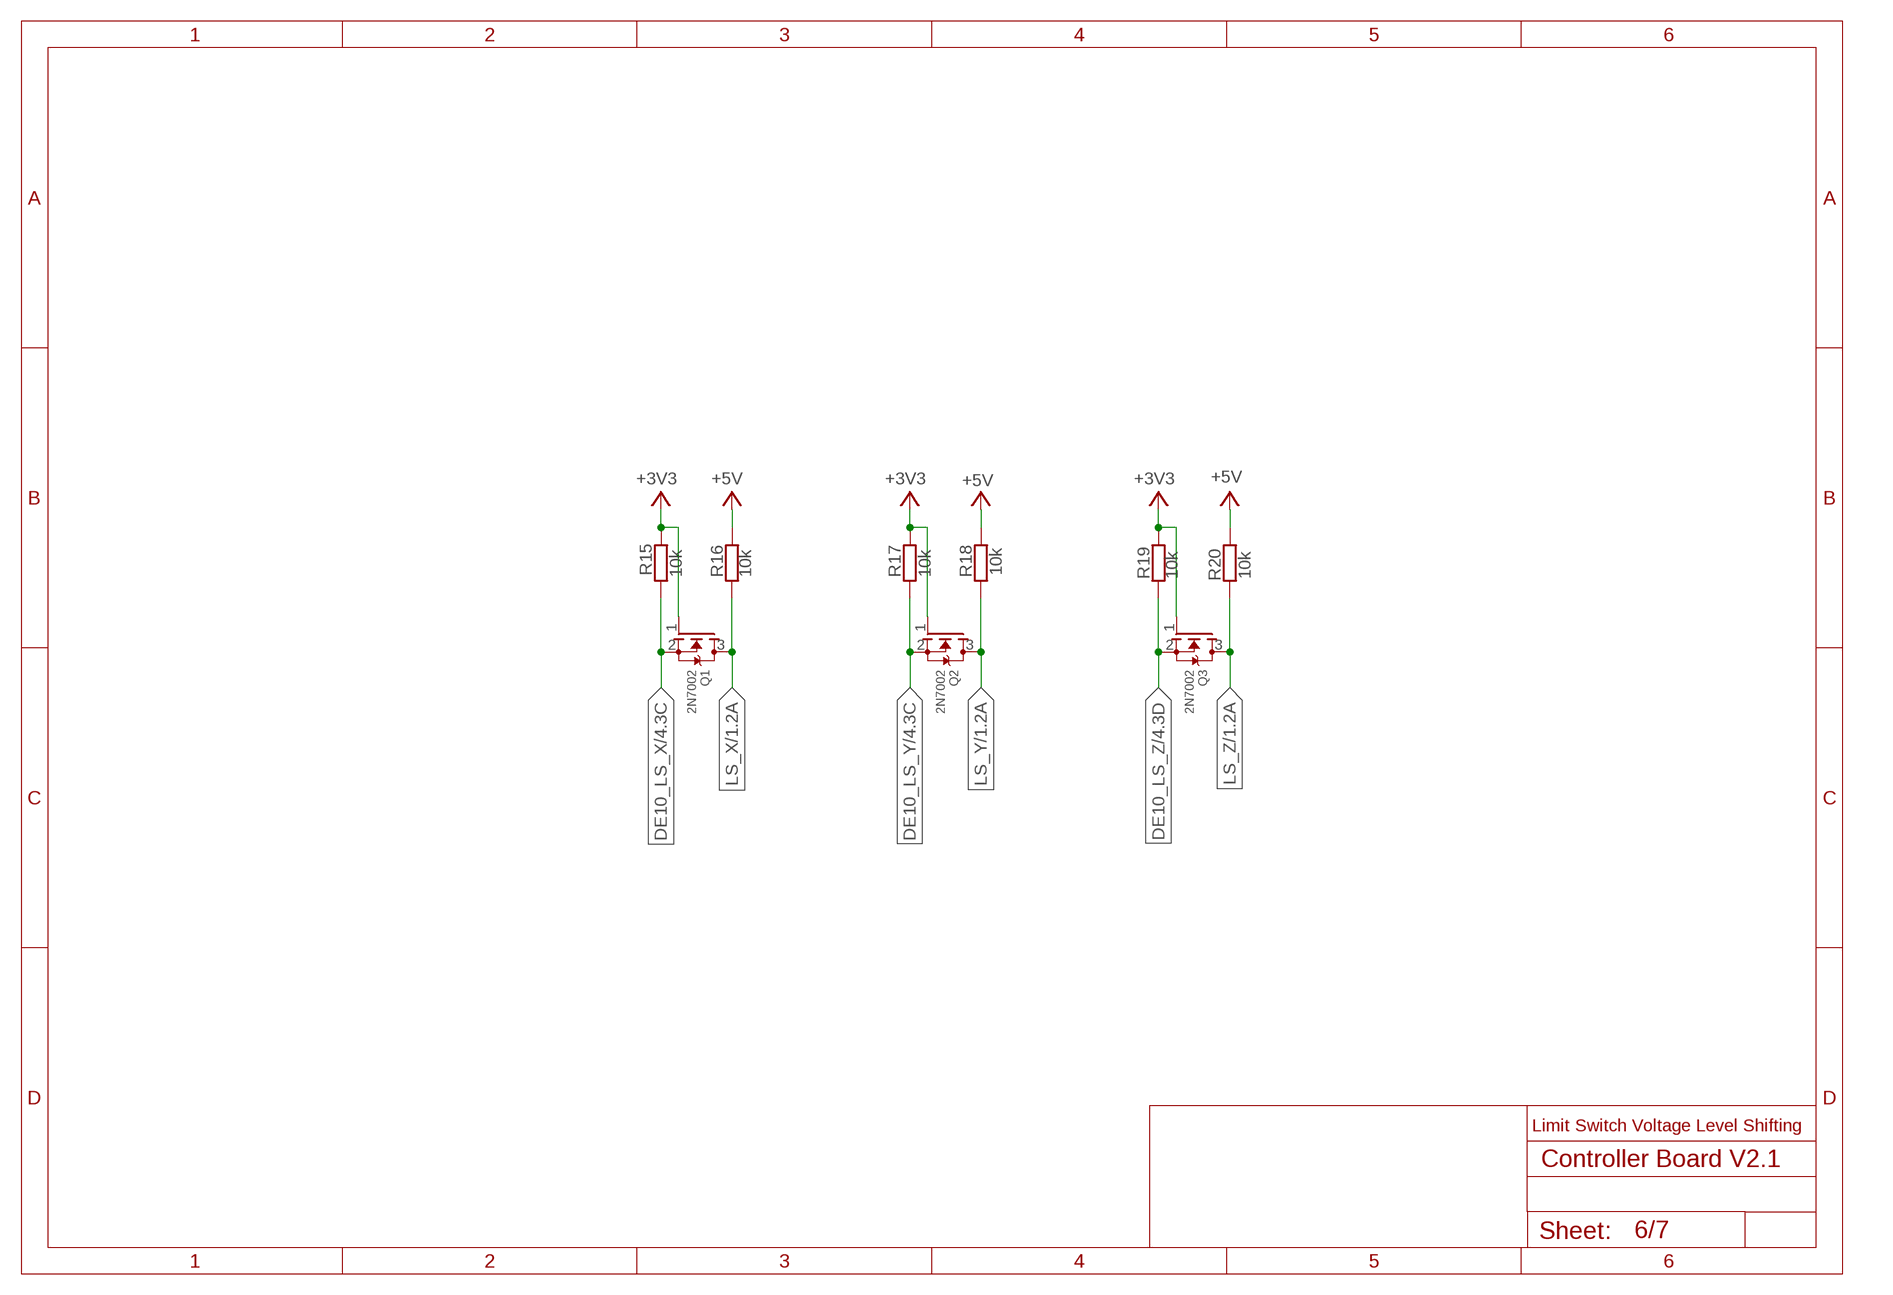
[diagram p5: schematic, sheet 6]

### Parts
Q1  2N7002  MOSFET-NREFLOW  [SOT23]
Q2  2N7002  MOSFET-NREFLOW  [SOT23]
Q3  2N7002  MOSFET-NREFLOW  [SOT23]
R15  10k  R-EU_R0805  [R0805]
R16  10k  R-EU_R0805  [R0805]
R17  10k  R-EU_R0805  [R0805]
R18  10k  R-EU_R0805  [R0805]
R19  10k  R-EU_R0805  [R0805]
R20  10k  R-EU_R0805  [R0805]

### Nets
+3V3: Q1.1(G) Q2.1(G) Q3.1(G) R15.2 R17.2 R19.2 ; also sheet 1,2,3,4
+5V: R16.2 R18.2 R20.2 ; also sheet 1,2,3,4
DE10_LS_X: Q1.2(S) R15.1 ; also sheet 4
DE10_LS_Y: Q2.2(S) R17.1 ; also sheet 4
DE10_LS_Z: Q3.2(S) R19.1 ; also sheet 4
LS_X: Q1.3(D) R16.1 ; also sheet 1
LS_Y: Q2.3(D) R18.1 ; also sheet 1
LS_Z: Q3.3(D) R20.1 ; also sheet 1

### Notes on the sheet
- Limit Switch Voltage Level Shifting

## Sheet 7 of 7
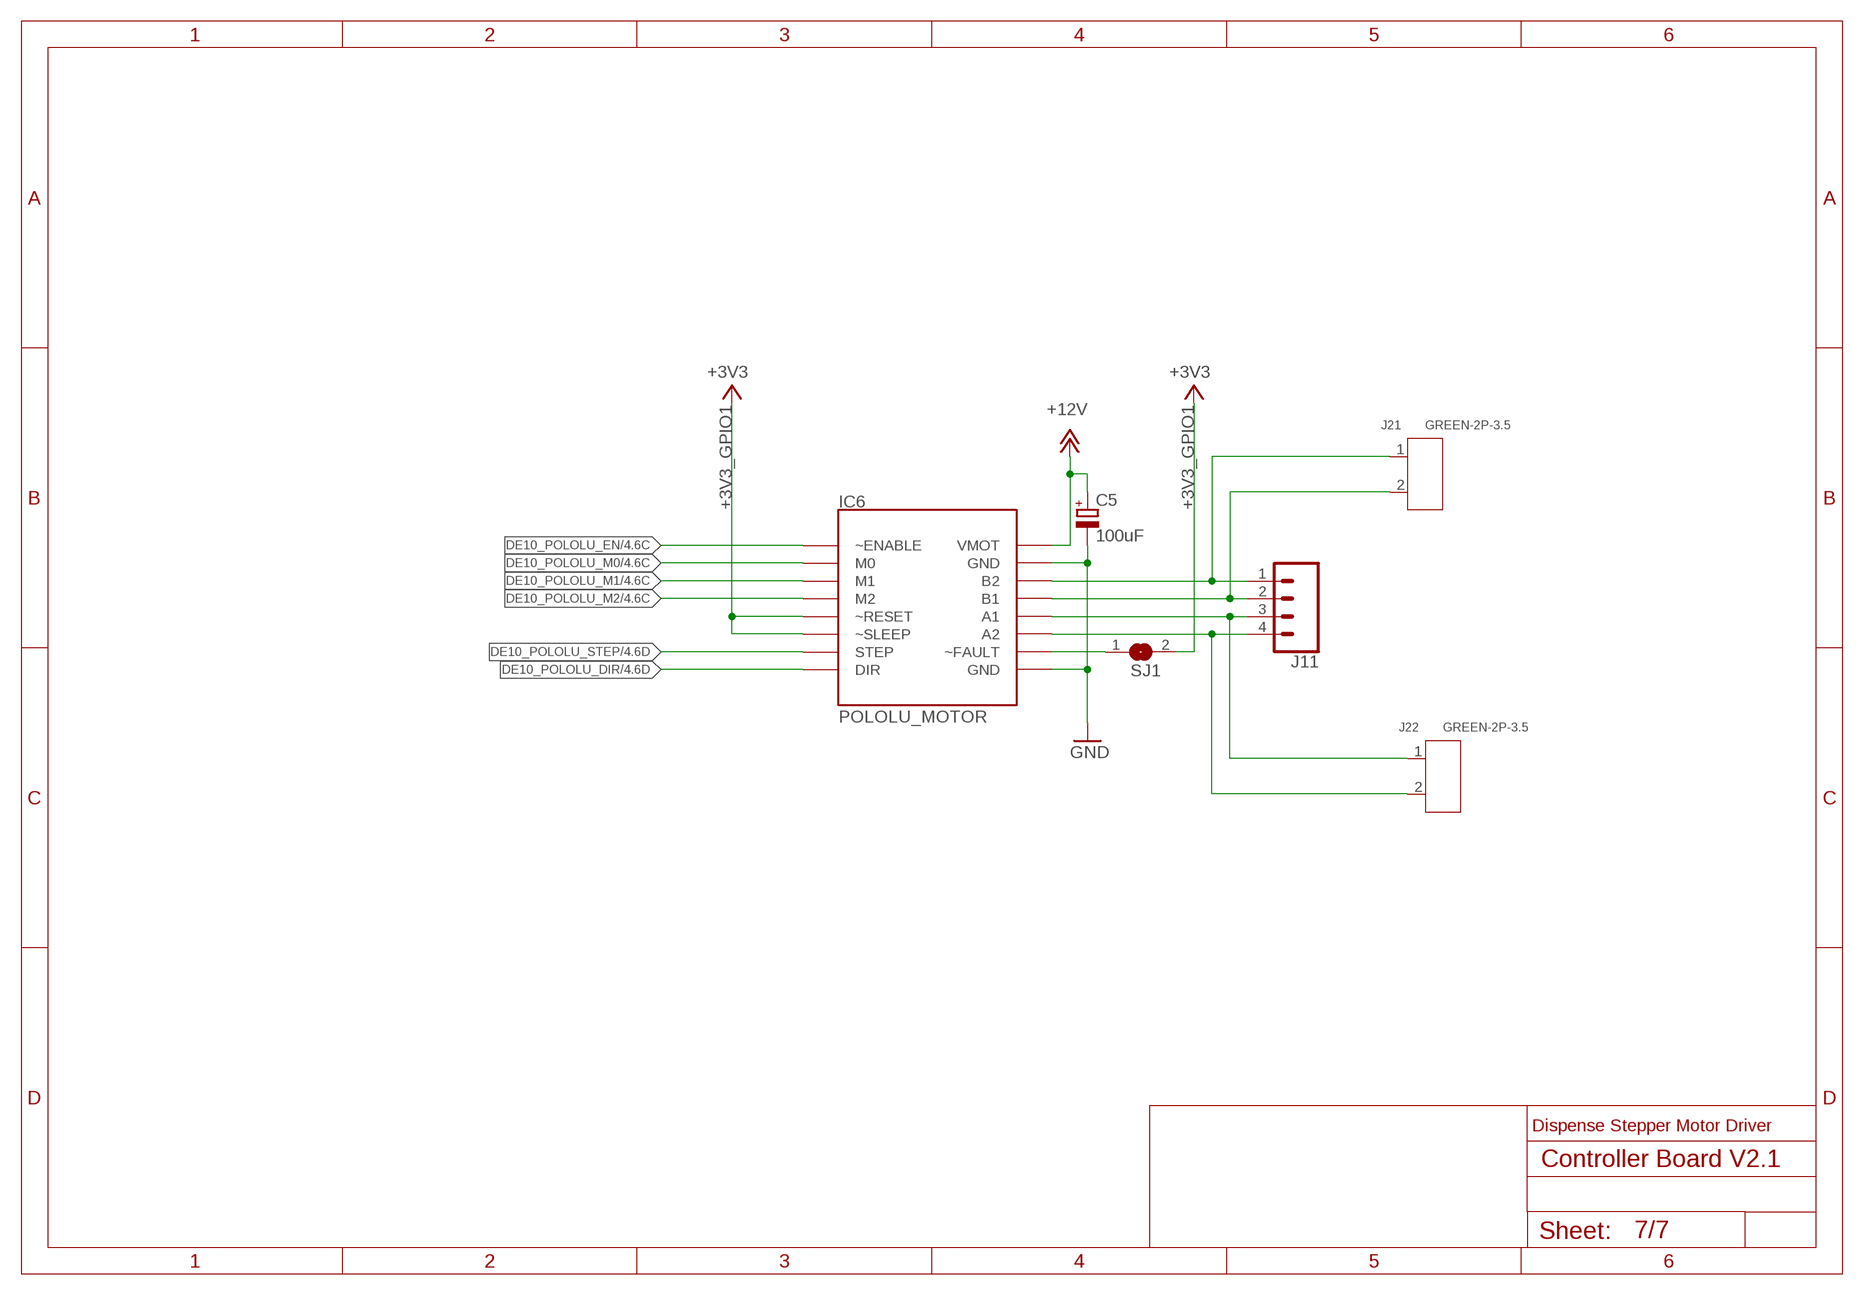
[diagram p6: schematic, sheet 7]

### Parts
C5  100uF  CPOL-EU153CLV-0810  [153CLV-0810]
IC6  POLOLU_MOTOR  [POLOLU_MOTOR]
J11  CONN_04  [1X04]
J21  GREEN-2P-3.5  SCREW-TERMINAL-GREEN(2P-3.5)  [H2-3.5-7.0X7.0MM]
J22  GREEN-2P-3.5  SCREW-TERMINAL-GREEN(2P-3.5)  [H2-3.5-7.0X7.0MM]
SJ1  SJ  [SJ]

### Nets
+3V3_GPIO1: IC6.~RESET IC6.~SLEEP SJ1.2 ; supply symbol labelled +3V3 ; also sheet 3,4
+12V: C5.+ IC6.VMOT ; also sheet 1,3,4,5
A1: IC6.A1 J11.3 J22.1
A2: IC6.A2 J11.4 J22.2
B1: IC6.B1 J11.2 J21.2
B2: IC6.B2 J11.1 J21.1
DE10_POLOLU_DIR: IC6.DIR ; also sheet 4
DE10_POLOLU_EN: IC6.~ENABLE ; also sheet 4
DE10_POLOLU_M0: IC6.M0 ; also sheet 4
DE10_POLOLU_M1: IC6.M1 ; also sheet 4
DE10_POLOLU_M2: IC6.M2 ; also sheet 4
DE10_POLOLU_STEP: IC6.STEP ; also sheet 4
GND: C5.- IC6.GND@0(GND) IC6.GND@1(GND) ; also sheet 1,2,3,4,5
STEPPER_FAULT: IC6.~FAULT SJ1.1

### Notes on the sheet
- Dispense Stepper Motor Driver

## Library data of the parts
C1 C3-C5 C8 = rcl:CPOL-EU: POLARIZED CAPACITOR, European symbol; SPICEPREFIX: C
C2 C6 C7 = rcl:C-EU: CAPACITOR, European symbol; SPICEPREFIX: C
D1 D4 = SparkFun-DiscreteSemi:DIODE-SCHOTTKY: Schottky diode A Schottky diode is a semiconductor diode which has a low forward voltage drop and a very fast switching action.; PROD_ID: DIO-08053
D3 D5 = Diodes:BAT54S: DIODE ARRAY SCHOTTKY 30V SOT23-3 Manufacturer's datasheet <https://www.onsemi.com/pub/Collateral/BAT54SLT1-D.PDF>; CREATED_BY: PCBLayout.com; DIGIKEY_PART_NUMBER: BAT54SFSCT-ND; MANUFACTURER: ON Semiconductor; MPN: BAT54S; PACKAGE: SOT-23
DE1 = Capstone:DE10_FOOTPRINT
IC1 IC2 IC4 = uln-udn:ULN2003A: DRIVER ARRAY
IC6 = Capstone:POLOLU_MOTOR
J1 J13 J17 = SparkFun-Connectors:CONN_02: Multi connection point. Often used as Generic Header-pin footprint for 0.1 inch spaced/style header connections On any of the 0.1 inch spaced packages, you can populate with these: Break Away Headers - Straight <https://www.sparkfun.com/products/116> (PRT-00116) Break Away Male Headers - Right Angle <https://www.sparkfun.com/products/553> (PRT-00553) Female Headers <https://www.sparkfun.com/products/115> (PRT-00115) Break Away Headers - Machine Pin <https://www.sparkfun.com/products/117> (PRT-00117) Break Away Female Headers - Swiss Machine Pin <https://www.sparkfun.com/products/743> (PRT-00743) For SCREWTERMINALS and SPRING TERMINALS visit here: Screw Terimnals on SparkFun.com <https://www.sparkfun.com/search/results?term=Screw+Terminals> (5mm/3.5mm/2.54mm spacing) This device is also useful as a general connection point to wire up your design to another part of your project. Our various solder wires solder well into these plated through hole pads. Hook-Up Wire - Assortment (Stranded, 22 AWG) <https://www.sparkfun.com/products/11375> (PRT-11375) Hook-Up Wire - Assortment (Solid Core, 22 AWG) <https://www.sparkfun.com/products/11367> (PRT-11367) View the entire wire category on our website here <https://www.sparkfun.com/categories/141> Special notes: Molex polarized connector foot print use with: PRT-08233 with associated crimp pins and housings. 2.54_SCREWTERM for use with PRT-10571. 3.5mm Screw Terminal footprints for PRT-08084 5mm Screw Terminal footprints for use with PRT-08432
J2 = Connectors:B3P-VH(LF)(SN): CONN HEADER VERT 3POS 3.96MM Manufacturer's datasheet <http://www.jst-mfg.com/product/pdf/eng/eVH.pdf>; CREATED_BY: PCBLayout.com; DIGIKEY_PART_NUMBER: 455-1640-ND; MANUFACTURER: JST Sales America Inc.; MPN: B3P-VH(LF)(SN)
J3 = Capstone:JST_18-PIN
J4 = Capstone:JST_3-PIN
J5 = Capstone:JST_10-PIN
J6 = Capstone:JST_9-PIN
J7 = Capstone:JST_6P_2MM
J8 = Capstone:CONN_05X2_2MM
J9 = Capstone:CONN_25X2
J10 = Capstone:USB_PLUG
J11 J14 = SparkFun-Connectors:CONN_04: Multi connection point. Often used as Generic Header-pin footprint for 0.1 inch spaced/style header connections On any of the 0.1 inch spaced packages, you can populate with these: Break Away Headers - Straight <https://www.sparkfun.com/products/116> (PRT-00116) Break Away Male Headers - Right Angle <https://www.sparkfun.com/products/553> (PRT-00553) Female Headers <https://www.sparkfun.com/products/115> (PRT-00115) Break Away Headers - Machine Pin <https://www.sparkfun.com/products/117> (PRT-00117) Break Away Female Headers - Swiss Machine Pin <https://www.sparkfun.com/products/743> (PRT-00743) For SCREWTERMINALS and SPRING TERMINALS visit here: Screw Terimnals on SparkFun.com <https://www.sparkfun.com/search/results?term=Screw+Terminals> (5mm/3.5mm/2.54mm spacing) This device is also useful as a general connection point to wire up your design to another part of your project. Our various solder wires solder well into these plated through hole pads. Hook-Up Wire - Assortment (Stranded, 22 AWG) <https://www.sparkfun.com/products/11375> (PRT-11375) Hook-Up Wire - Assortment (Solid Core, 22 AWG) <https://www.sparkfun.com/products/11367> (PRT-11367) View the entire wire category on our website here <https://www.sparkfun.com/categories/141> Special notes: Molex polarized connector foot print use with SKU : PRT-08231 with associated crimp pins and housings. 1MM SMD Version SKU: PRT-10208; PROD_ID: CONN-09696
J12 J19 J20 = SparkFun-Connectors:CONN_05X2: Multi connection point. Often used as Generic Header-pin footprint for 0.1 inch spaced/style header connections For AVR SPI programming port, see special device with nice symbol: "AVR_SPI_PROG_5x2.dev" You can populate with any combo of single row headers, but if you'd like an exact match, check these: 2x5 AVR ICSP Male Header <https://www.sparkfun.com/products/778> (PRT-00778) 2x5 Pin Shrouded Header <https://www.sparkfun.com/products/8506> (PRT-08506) On any of the 0.1 inch spaced packages, you can populate with these: Break Away Headers - Straight <https://www.sparkfun.com/products/116> (PRT-00116) Break Away Male Headers - Right Angle <https://www.sparkfun.com/products/553> (PRT-00553) Female Headers <https://www.sparkfun.com/products/115> (PRT-00115) Break Away Headers - Machine Pin <https://www.sparkfun.com/products/117> (PRT-00117) Break Away Female Headers - Swiss Machine Pin <https://www.sparkfun.com/products/743> (PRT-00743) Special note: the shrouded connector mates well with our 5x2 ribbon cables: 2x5 Pin IDC Ribbon Cable <https://www.sparkfun.com/products/8535> (PRT-08535); PROD_ID: CONN-08499; SF_ID: PRT-0778
J15 = Capstone:JST_11-PIN
J16 = Capstone:JST_7-PIN
J18 = OPL_Connector:SCREW-TERMINAL-GREEN(2P-5.0): 320110031
J21 J22 = OPL_Connector:SCREW-TERMINAL-GREEN(2P-3.5): 320110028
K1 = relay:G2R: RELAY 1 x switch, Omron; OC_FARNELL: 1569185; OC_NEWARK: unknown
LED1 LED2 = led:LED: LED OSRAM: - CHIPLED LG R971, LG N971, LY N971, LG Q971, LY Q971, LO R971, LY R971 LH N974, LH R974 LS Q976, LO Q976, LY Q976 LO Q996 - Hyper CHIPLED LW Q18S LB Q993, LB Q99A, LB R99A - SideLED LS A670, LO A670, LY A670, LG A670, LP A670 LB A673, LV A673, LT A673, LW A673 LH A674 LY A675 LS A676, LA A676, LO A676, LY A676, LW A676 LS A679, LY A679, LG A679 - Hyper Micro SIDELED® LS Y876, LA Y876, LO Y876, LY Y876 LT Y87S - SmartLED LW L88C, LW L88S LB L89C, LB L89S, LG L890 LS L89K, LO L89K, LY L89K LS L896, LA L896, LO L896, LY L896 - TOPLED LS T670, LO T670, LY T670, LG T670, LP T670 LSG T670, LSP T670, LSY T670, LOP T670, LYG T670 LG T671, LOG T671, LSG T671 LB T673, LV T673, LT T673, LW T673 LH T674 LS T676, LA T676, LO T676, LY T676, LB T676, LH T676, LSB T676, LW T676 LB T67C, LV T67C, LT T67C, LS T67K, LO T67K, LY T67K, LW E67C LS E67B, LA E67B, LO E67B, LY E67B, LB E67C, LV E67C, LT E67C LW T67C LS T679, LY T679, LG T679 LS T770, LO T770, LY T770, LG T770, LP T770 LB T773, LV T773, LT T773, LW T773 LH T774 LS E675, LA E675, LY E675, LS T675 LS T776, LA T776, LO T776, LY T776, LB T776 LHGB T686 LT T68C, LB T68C - Hyper Mini TOPLED® LB M676 - Mini TOPLED Santana® LG M470 LS M47K, LO M47K, LY M47K Source: http://www.osram.convergy.de LUXEON: - LUMILED® LXK2-PW12-R00, LXK2-PW12-S00, LXK2-PW14-U00, LXK2-PW14-V00 LXK2-PM12-R00, LXK2-PM12-S00, LXK2-PM14-U00 LXK2-PE12-Q00, LXK2-PE12-R00, LXK2-PE12-S00, LXK2-PE14-T00, LXK2-PE14-U00 LXK2-PB12-K00, LXK2-PB12-L00, LXK2-PB12-M00, LXK2-PB14-N00, LXK2-PB14-P00, LXK2-PB14-Q00 LXK2-PR12-L00, LXK2-PR12-M00, LXK2-PR14-Q00, LXK2-PR14-R00 LXK2-PD12-Q00, LXK2-PD12-R00, LXK2-PD12-S00 LXK2-PH12-R00, LXK2-PH12-S00 LXK2-PL12-P00, LXK2-PL12-Q00, LXK2-PL12-R00 Source: www.luxeon.com KINGBRIGHT: KA-3528ASYC Source: www.kingbright.com
OK1 OK2 = Capstone:LTV846: OPTO COUPLER Source: LITEON, LTV816.pdf
Q1-Q4 = adafruit:MOSFET-N: N-Channel Mosfet 2N7002E - 60V 260mA SOT23 [Digikey: 2N7002ET1GOSTR-ND] - REEL BSH103 - 30V 850mA SOT23 [Digikey: 568-5013-1-ND]
R1-R24 R30-R32 = rcl:R-EU_: RESISTOR, European symbol; SPICEPREFIX: R
R25-R28 = OPL_Resistor:SMD-RES-ARRAY-1K-4R(RA1206-8): 301030012; MPN: Chip-Array-Series-1%
R29 = OPL_Resistor:SMD-RES-ARRAY-1K-4R(RA1206-8): 301030012; MPN: Chip-Array-Series-1%; VALUE: 1K
RN1 = One_Dimensional_Pong:CAT16-J8: https://www.bourns.com/docs/Product-Datasheets/CATCAY.pdf
S1 S2 = adafruit:EG1218: SLIDING SWITCH 0.1" spacing through hole, vertical SPDT slide switch http://www.ladyada.net/library/pcb/eaglelibrary.html
SJ1 = jumper:SJ: SMD solder JUMPER
U$1 = Capstone:PC104_FOOTPRINT

## Board
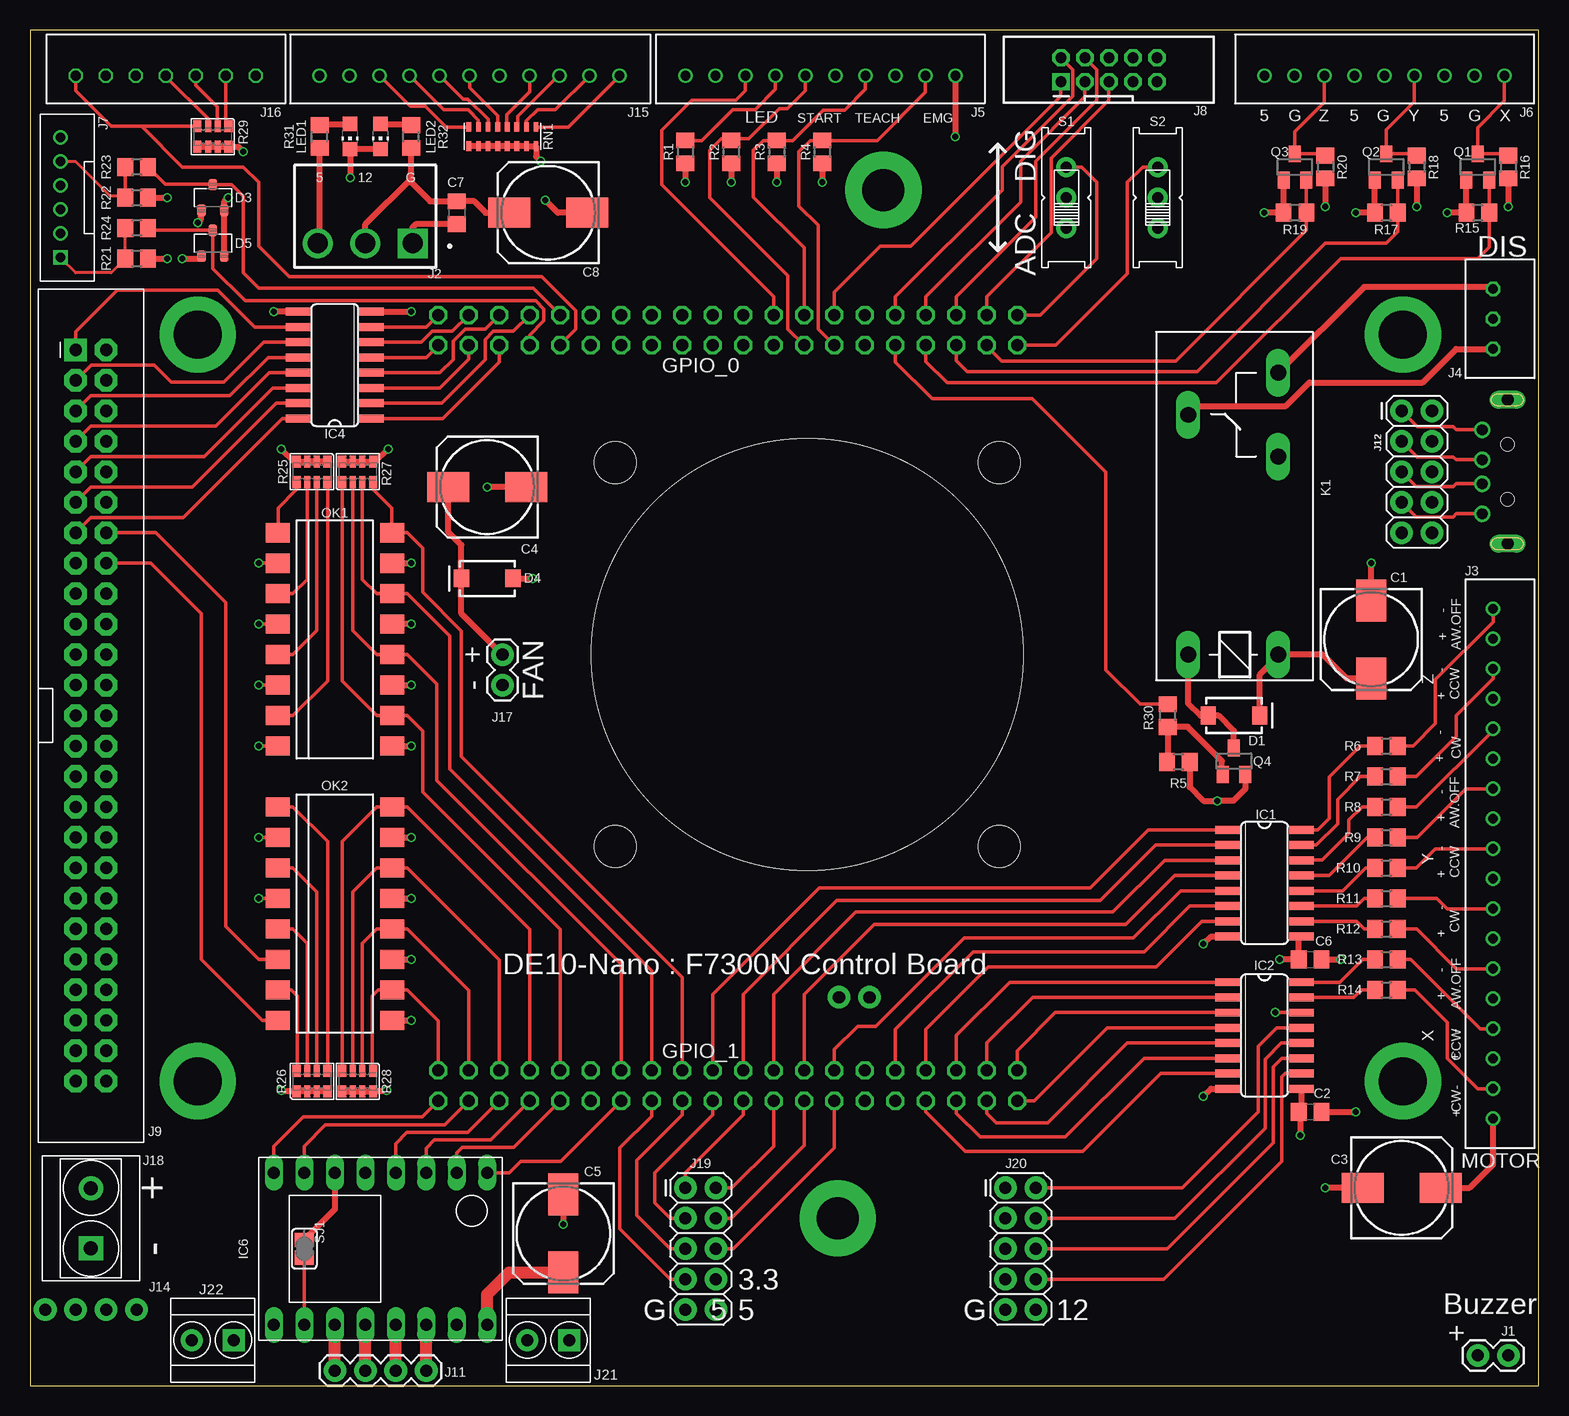
[diagram p7: board, top side]
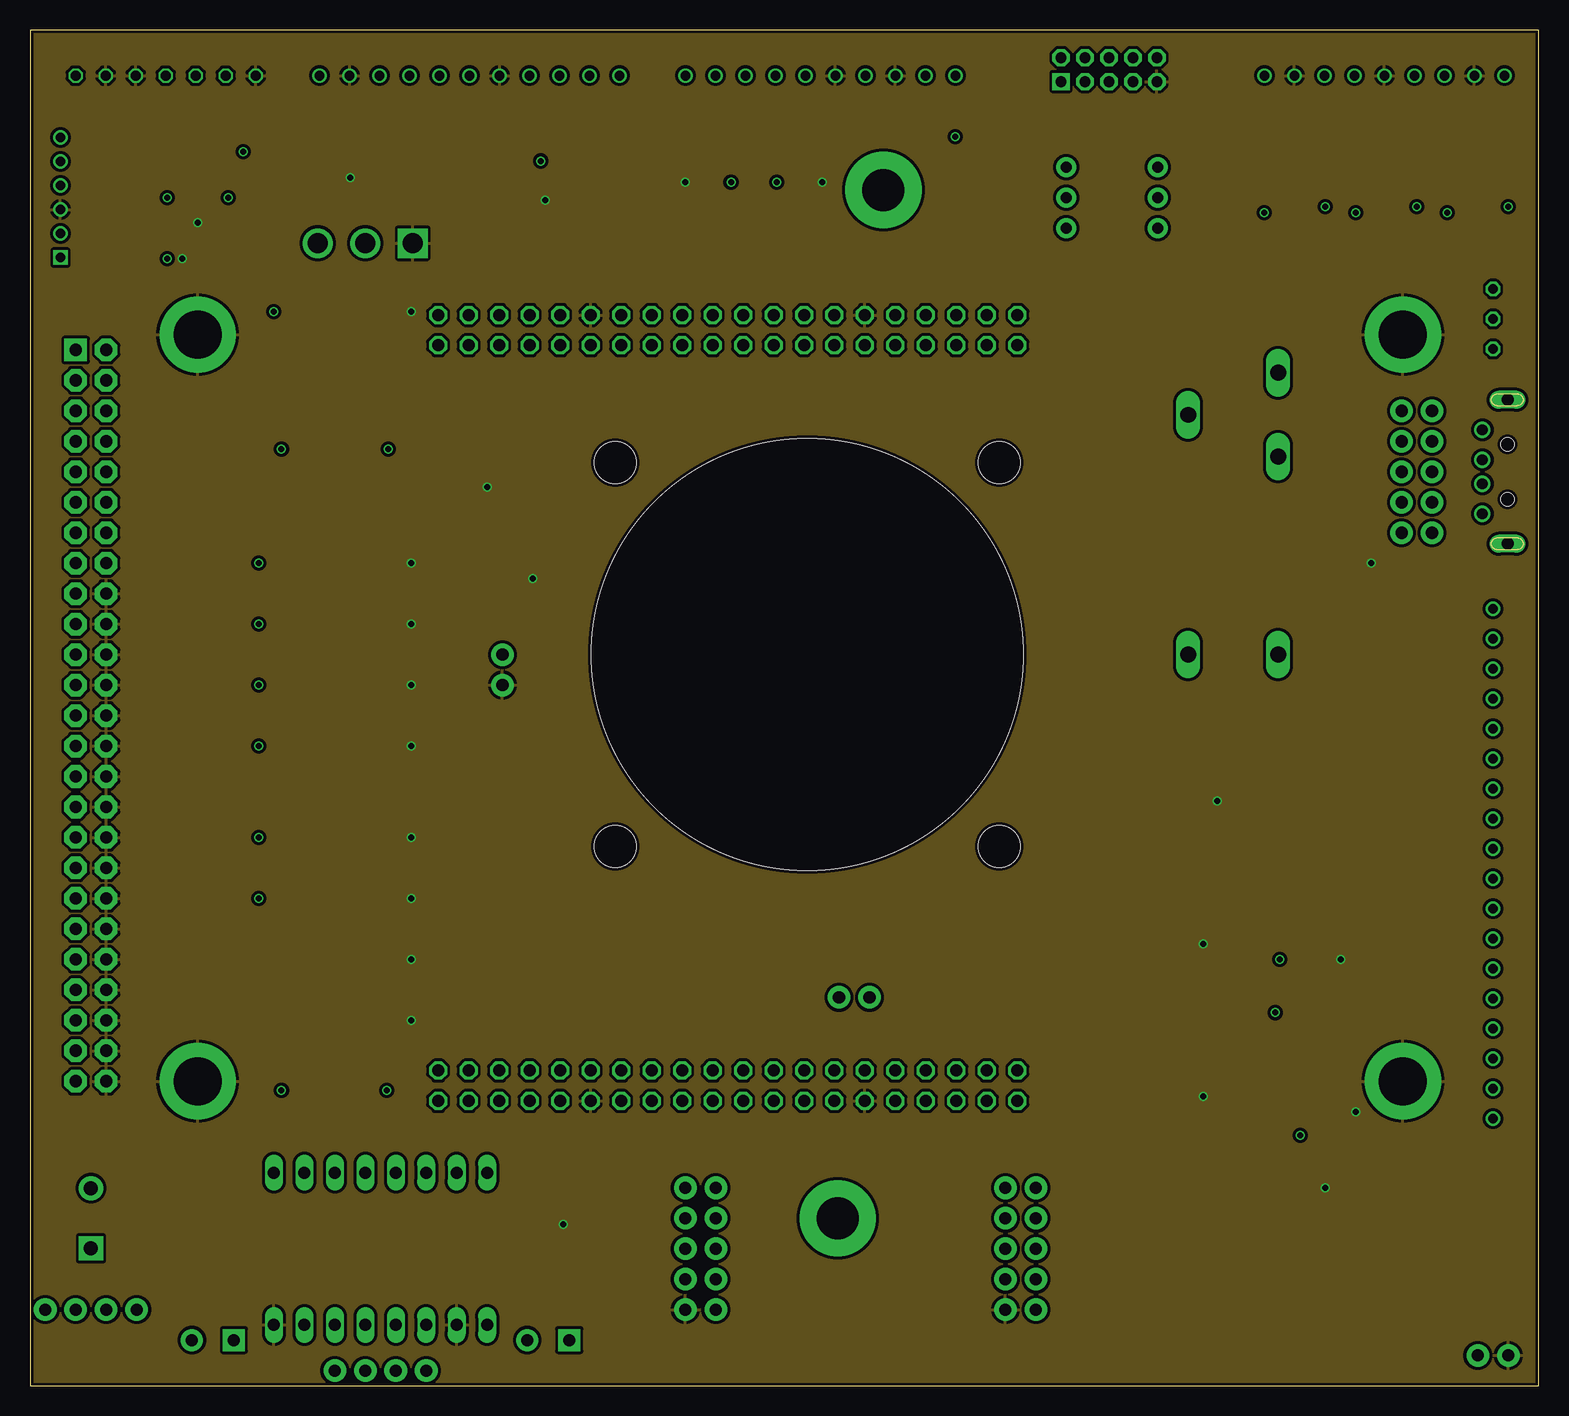
[diagram p8: board, inner layer Route2]
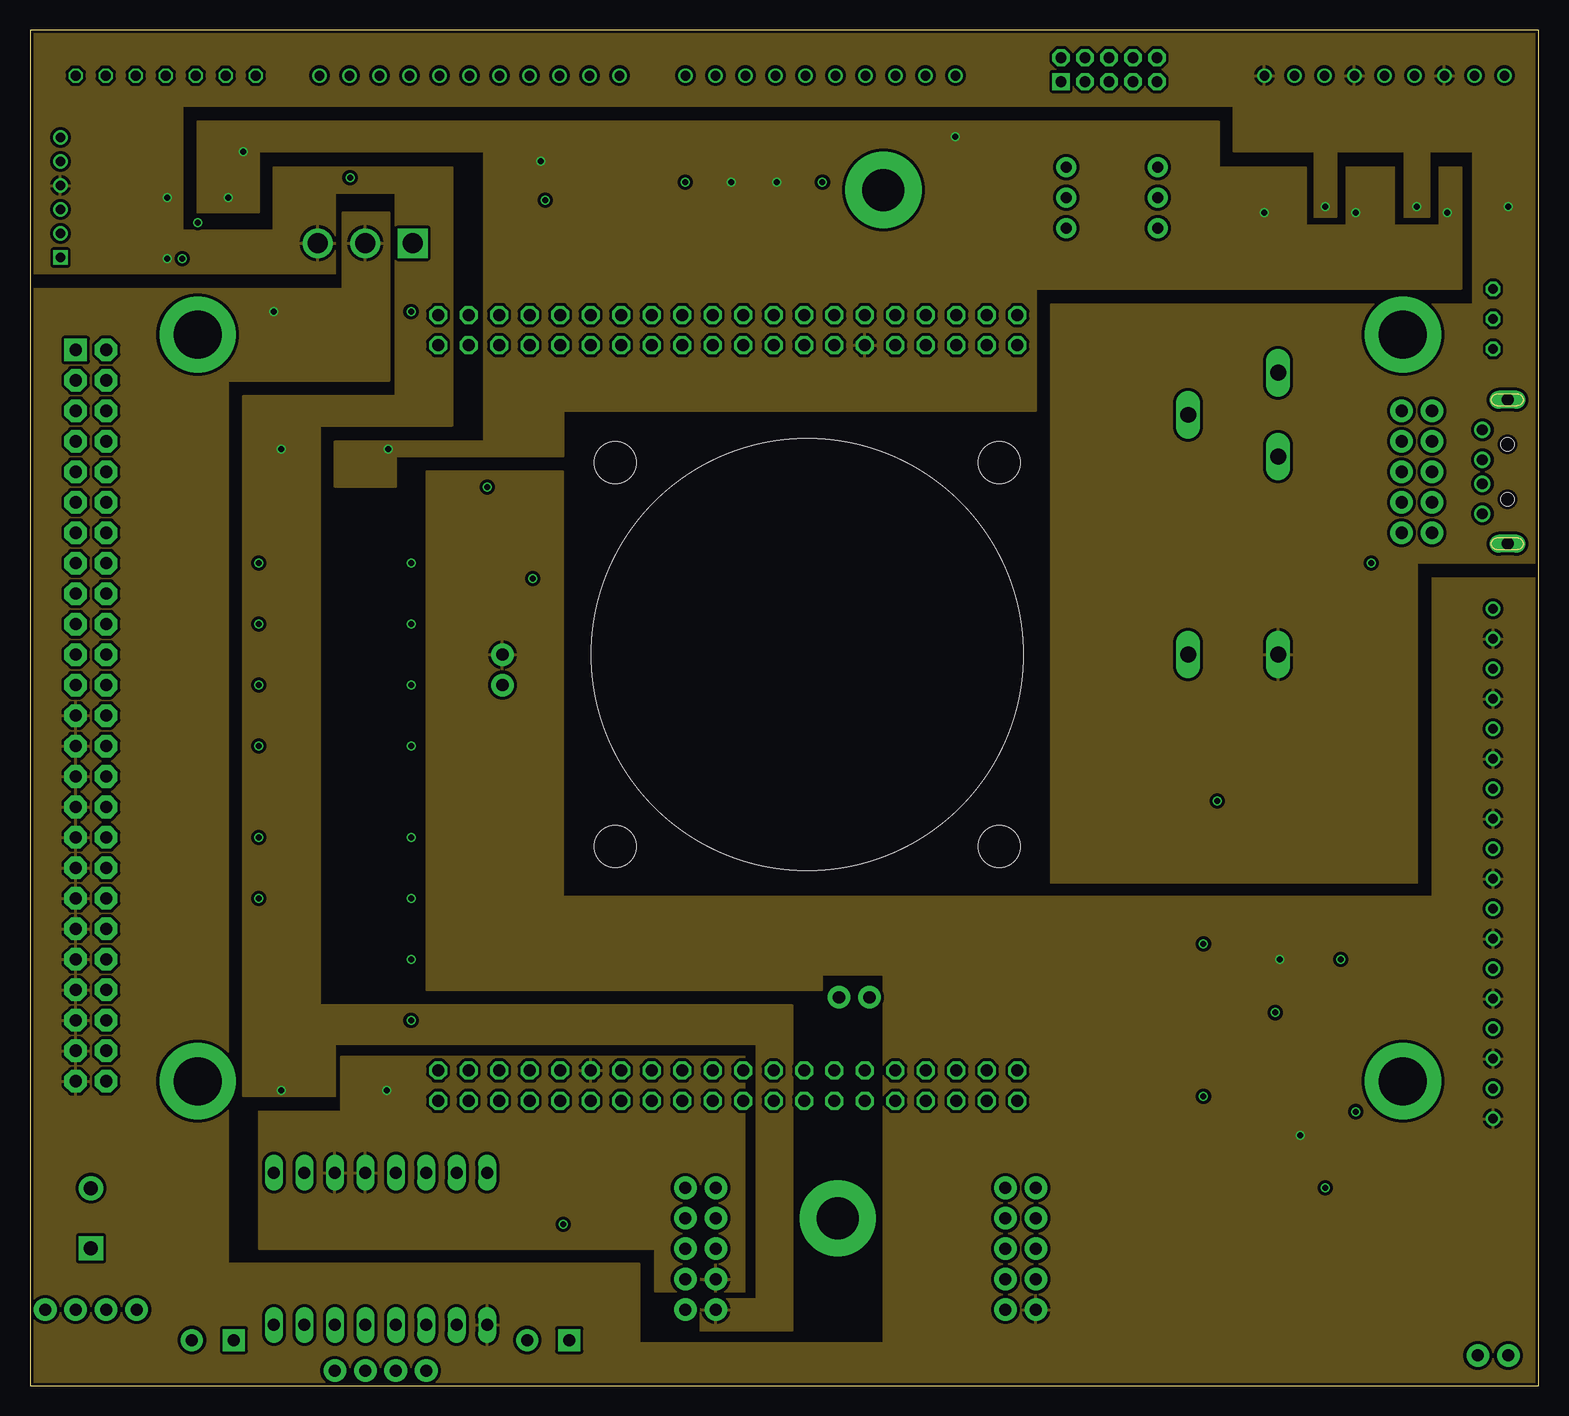
[diagram p9: board, inner layer Route15]
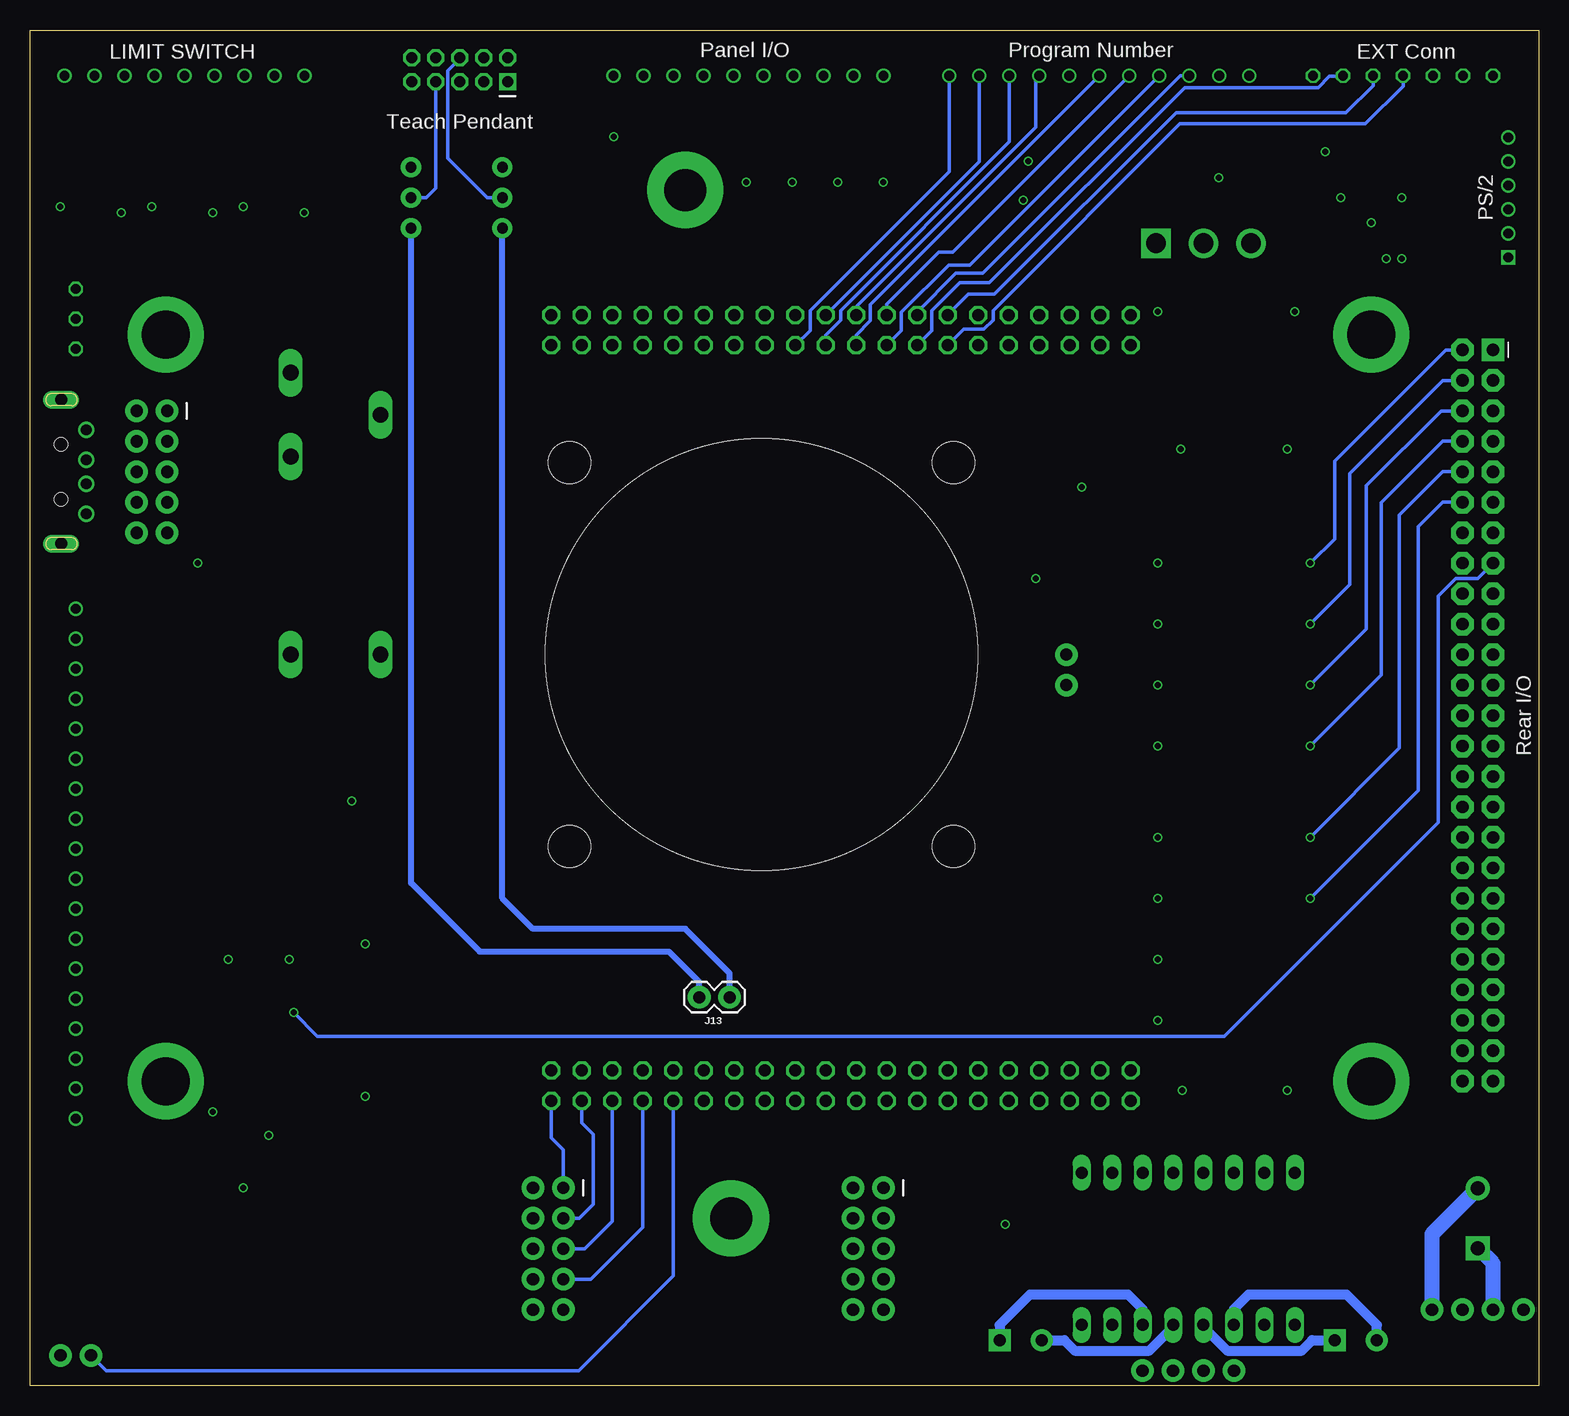
[diagram p10: board, bottom side, seen from below]

Size 125.73 x 113.03 mm. Coordinates in mm from the lower left corner, seen from the top.
Outline: 0,113.03 0,0 125.73,0 125.73,113.03 0,113.03
Copper layers (1*2*15*16): Top 0.035559375mm / dielectric 0.17018125mm / Route2 0.01778125mm / dielectric 47mil / Route15 0.01778125mm / dielectric 0.17018125mm / Bottom 0.035559375mm
Design rules "jlcpcb-4-layer *": minimum track width 5mil, minimum drill 0.5mm, track to track 0.126490625mm, track to pad 0.126490625mm, pad to pad 0.126490625mm, via to via 0.126490625mm, smd to smd 0mil, copper to edge 0.1mm, drill to drill 5mil, minimum pad ring 4mil, minimum via ring 4mil, stop-mask expansion 3mil, vias tented up to drill 100mil, thermal gap 10mil

### Footprints (pad centres in the part's own frame; a part is rotated, then mirrored left to right if it is on the bottom)
153CLV-0810 = smd 3.5 x 2.5: + 3.25,0; - -3.25,0
C0805 = smd 1.3 x 1.5: 1 -0.95,0; 2 0.95,0
SMA-DIODE = smd 1.27 x 1.47: A -2.15,0; C 2.15,0
SOT23 = smd 0.71 x 0.96: 1 -0.95,-1.075; 2 0.95,-1.075; 3 0,1.075
DE10_FOOTPRINT = drill 1 octagon: GPIO_0_1 20.05,61.34; GPIO_0_2 20.05,63.88; GPIO_0_3 22.59,61.34; GPIO_0_4 22.59,63.88; GPIO_0_5 25.13,61.34; GPIO_0_6 25.13,63.88; GPIO_0_7 27.67,61.34; GPIO_0_8 27.67,63.88; GPIO_0_9 30.21,61.34; GPIO_0_10 30.21,63.88; GPIO_0_11 32.75,61.34; GPIO_0_12 32.75,63.88; GPIO_0_13 35.29,61.34; GPIO_0_14 35.29,63.88; GPIO_0_15 37.83,61.34; GPIO_0_16 37.83,63.88; GPIO_0_17 40.37,61.34; GPIO_0_18 40.37,63.88; GPIO_0_19 42.91,61.34; GPIO_0_20 42.91,63.88; GPIO_0_21 45.45,61.34; GPIO_0_22 45.45,63.88; GPIO_0_23 47.99,61.34; GPIO_0_24 47.99,63.88; GPIO_0_25 50.53,61.34; GPIO_0_26 50.53,63.88; GPIO_0_27 53.07,61.34; GPIO_0_28 53.07,63.88; GPIO_0_29 55.61,61.34; GPIO_0_30 55.61,63.88; GPIO_0_31 58.15,61.34; GPIO_0_32 58.15,63.88; GPIO_0_33 60.69,61.34; GPIO_0_34 60.69,63.88; GPIO_0_35 63.23,61.34; GPIO_0_36 63.23,63.88; GPIO_0_37 65.77,61.34; GPIO_0_38 65.77,63.88; GPIO_0_39 68.31,61.34; GPIO_0_40 68.31,63.88; GPIO_1_1 68.31,0.89; GPIO_1_2 68.31,-1.65; GPIO_1_3 65.77,0.89; GPIO_1_4 65.77,-1.65; GPIO_1_5 63.23,0.89; GPIO_1_6 63.23,-1.65; GPIO_1_7 60.69,0.89; GPIO_1_8 60.69,-1.65; GPIO_1_9 58.15,0.89; GPIO_1_10 58.15,-1.65; GPIO_1_11 55.61,0.89; GPIO_1_12 55.61,-1.65; GPIO_1_13 53.07,0.89; GPIO_1_14 53.07,-1.65; GPIO_1_15 50.53,0.89; GPIO_1_16 50.53,-1.65; GPIO_1_17 47.99,0.89; GPIO_1_18 47.99,-1.65; GPIO_1_19 45.45,0.89; GPIO_1_20 45.45,-1.65; GPIO_1_21 42.91,0.89; GPIO_1_22 42.91,-1.65; GPIO_1_23 40.37,0.89; GPIO_1_24 40.37,-1.65; GPIO_1_25 37.83,0.89; GPIO_1_26 37.83,-1.65; GPIO_1_27 35.29,0.89; GPIO_1_28 35.29,-1.65; GPIO_1_29 32.75,0.89; GPIO_1_30 32.75,-1.65; GPIO_1_31 30.21,0.89; GPIO_1_32 30.21,-1.65; GPIO_1_33 27.67,0.89; GPIO_1_34 27.67,-1.65; GPIO_1_35 25.13,0.89; GPIO_1_36 25.13,-1.65; GPIO_1_37 22.59,0.89; GPIO_1_38 22.59,-1.65; GPIO_1_39 20.05,0.89; GPIO_1_40 20.05,-1.65 | drill 4 pad 6.35: P$1 0,0; P$2 100.44,0; P$3 0,62.23; P$4 100.44,62.23
SO16 = smd 0.66 x 2.032: 1 -4.445,-3.073; 2 -3.175,-3.073; 3 -1.905,-3.073; 4 -0.635,-3.073; 5 0.635,-3.073; 6 1.905,-3.073; 7 3.175,-3.073; 8 4.445,-3.073; 9 4.445,3.073; 10 3.175,3.073; 11 1.905,3.073; 12 0.635,3.073; 13 -0.635,3.073; 14 -1.905,3.073; 15 -3.175,3.073; 16 -4.445,3.073
POLOLU_MOTOR = drill 1 long: A1 6.35,-1.27; A2 6.35,-3.81; B1 6.35,1.27; B2 6.35,3.81; DIR -6.35,-8.89; GND@0 6.35,-8.89; GND@1 6.35,6.35; M0 -6.35,6.35; M1 -6.35,3.81; M2 -6.35,1.27; STEP -6.35,-6.35; VMOT 6.35,8.89; ~ENABLE -6.35,8.89; ~FAULT 6.35,-6.35; ~RESET -6.35,-1.27; ~SLEEP -6.35,-3.81
1X02 = drill 1.016 pad 1.88: 1 0,0; 2 2.54,0
HDR-03 = drill 1.65 square: 1 -3.96,0 | drill 1.65: 2 0,0; 3 3.96,0
JST_18-PIN = drill 0.8: 1 0,0; 2 2.5,0; 3 5,0; 4 7.5,0; 5 10,0; 6 12.5,0; 7 15,0; 8 17.5,0; 9 20,0; 10 22.5,0; 11 25,0; 12 27.5,0; 13 30,0; 14 32.5,0; 15 35,0; 16 37.5,0; 17 40,0; 18 42.5,0
JST_3-PIN = drill 0.8 octagon: 1 0,0; 2 2.5,0; 3 5,0
JST_10-PIN = drill 0.8: 1 0,0; 2 2.5,0; 3 5,0; 4 7.5,0; 5 10,0; 6 12.5,0; 7 15,0; 8 17.5,0; 9 20,0; 10 22.5,0
JST_9-PIN = drill 0.8: 1 0,0; 2 2.5,0; 3 5,0; 4 7.5,0; 5 10,0; 6 12.5,0; 7 15,0; 8 17.5,0; 9 20,0
JST_6P_2MM = drill 0.8 square: P$1 -5,0 | drill 0.8: P$2 -3,0; P$3 -1,0; P$4 1,0; P$5 3,0; P$6 5,0
2X5-SHROUDED-2MM = drill 0.9 pad 1.422 square: 1 -1,4 | drill 0.9 pad 1.422 octagon: 2 1,4; 3 -1,2; 4 1,2; 5 -1,0; 6 1,0; 7 -1,-2; 8 1,-2; 9 -1,-4; 10 1,-4
2X25 = drill 1.016 pad 1.88 square: 1 -30.48,-1.27 | drill 1.016 pad 1.88 octagon: 2 -30.48,1.27; 3 -27.94,-1.27; 4 -27.94,1.27; 5 -25.4,-1.27; 6 -25.4,1.27; 7 -22.86,-1.27; 8 -22.86,1.27; 9 -20.32,-1.27; 10 -20.32,1.27; 11 -17.78,-1.27; 12 -17.78,1.27; 13 -15.24,-1.27; 14 -15.24,1.27; 15 -12.7,-1.27; 16 -12.7,1.27; 17 -10.16,-1.27; 18 -10.16,1.27; 19 -7.62,-1.27; 20 -7.62,1.27; 21 -5.08,-1.27; 22 -5.08,1.27; 23 -2.54,-1.27; 24 -2.54,1.27; 25 0,-1.27; 26 0,1.27; 27 2.54,-1.27; 28 2.54,1.27; 29 5.08,-1.27; 30 5.08,1.27; 31 7.62,-1.27; 32 7.62,1.27; 33 10.16,-1.27; 34 10.16,1.27; 35 12.7,-1.27; 36 12.7,1.27; 37 15.24,-1.27; 38 15.24,1.27; 39 17.78,-1.27; 40 17.78,1.27; 41 20.32,-1.27; 42 20.32,1.27; 43 22.86,-1.27; 44 22.86,1.27; 45 25.4,-1.27; 46 25.4,1.27; 47 27.94,-1.27; 48 27.94,1.27; 49 30.48,-1.27; 50 30.48,1.27
USB_PLUG = drill 0.9: D+ -1,0; D- 1,0; USB_GND -3.5,0; VBUS 3.5,0 | drill 1 long: P$1 -6,-2.1; P$2 6,-2.1 | hole 1.1: -2.3,-2.1; 2.3,-2.1
1X04 = drill 1.016 pad 1.88: 1 0,0; 2 2.54,0; 3 5.08,0; 4 7.62,0
2X5 = drill 1.016 pad 1.88: 1 0,0; 2 0,2.54; 3 2.54,0; 4 2.54,2.54; 5 5.08,0; 6 5.08,2.54; 7 7.62,0; 8 7.62,2.54; 9 10.16,0; 10 10.16,2.54
1X04_NO_SILK = drill 1.016 pad 1.88: 1 0,0; 2 2.54,0; 3 5.08,0; 4 7.62,0
JST_11-PIN = drill 0.8: 1 0,0; 2 2.5,0; 3 5,0; 4 7.5,0; 5 10,0; 6 12.5,0; 7 15,0; 8 17.5,0; 9 20,0; 10 22.5,0; 11 25,0
JST_7-PIN = drill 0.8 octagon: 1 0,0; 2 2.5,0; 3 5,0; 4 7.5,0; 5 10,0; 6 12.5,0; 7 15,0
H2-5.0-10.5X8.0MM = drill 1.168 pad 2.032 square: 1 0,2.5 | drill 1.168 pad 2.032: 2 0,-2.5
H2-3.5-7.0X7.0MM = drill 1 pad 1.85 square: 1 -1.75,0 | drill 1 pad 1.85: 2 1.75,0
G2R = drill 1.321 long: 1 -2.54,-3.683; 2 -2.54,3.81; O 13.97,-3.683; P 17.45,3.81; S 20.955,-3.683
CHIP-LED0805 = smd 1.2 x 1.2: A 0,-1.05; C 0,1.05
DIL8-SMD = smd 1.6 x 2: 1 -8.89,-4.77; 2 -6.35,-4.77; 3 -3.81,-4.77; 4 -1.27,-4.77; 5 1.27,-4.77; 6 3.81,-4.77; 7 6.35,-4.77; 8 8.89,-4.77; 9 8.89,4.77; 10 6.35,4.77; 11 3.81,4.77; 12 1.27,4.77; 13 -1.27,4.77; 14 -3.81,4.77; 15 -6.35,4.77; 16 -8.89,4.77
SOT23' = smd 1 x 1.4: 1 -0.95,-1.1; 2 0.95,-1.1; 3 0,1.1
R0805 = smd 1.3 x 1.5: 1 -0.95,0; 2 0.95,0
RA1206-8 = smd 0.7 x 1: 1 -1.3,-0.85; 4 1.3,-0.85; 5 1.3,0.85; 8 -1.3,0.85 | smd 0.5 x 1: 2 -0.4,-0.85; 3 0.4,-0.85; 6 0.4,0.85; 7 -0.4,0.85
RN8 = smd 0.8 x 0.4: 1 -0.8,2.8; 2 0.8,2.8; 3 -0.8,2; 4 0.8,2; 5 -0.8,1.2; 6 0.8,1.2; 7 -0.8,0.4; 8 0.8,0.4; 9 -0.8,-0.4; 10 0.8,-0.4; 11 -0.8,-1.2; 12 0.8,-1.2; 13 -0.8,-2; 14 0.8,-2; 15 -0.8,-2.8; 16 0.8,-2.8
EG1218 = drill 0.9 pad 1.676: O -2.54,0; P 0,0; S 2.54,0
SJ = smd 1.168 x 1.6: 1 -0.762,0; 2 0.762,0
PC104_FOOTPRINT = drill 3.5 pad 6.35: P$3 -5.08,5.08; P$4 -90.805,8.89
40MM-FAN = hole 36: 0,0 | hole 3.5: -16,-16; -16,16; 16,16; 16,-16

### Placement (x,y rotation side)
C1  111.76,62.23 270 top
C2  106.68,22.86 0 top
C3  114.3,16.51 0 top
C4  38.1,74.93 180 top
C5  44.45,12.7 270 top
C6  106.68,35.56 0 top
C7  35.56,97.79 270 top
C8  43.18,97.79 180 top
D1  100.33,55.88 0 top
D3  15.24,99.06 0 top
D4  38.1,67.31 180 top
D5  15.24,95.25 0 top
DE1  13.97,25.4 0 top
IC1  102.87,41.91 270 top
IC2  102.87,29.21 270 top
IC4  25.4,85.09 90 top
IC6  29.21,11.43 270 top
J1  123.19,2.54 180 top
J2  27.94,95.25 180 top
J3  121.92,64.77 270 top
J4  121.92,91.44 270 top
J5  54.61,109.22 0 top
J6  102.87,109.22 0 top
J7  2.54,99.06 90 top
J8  89.92,109.73 90 top
J9  5.08,55.88 270 top
J10  121.03,76.2 90 top
J11  33.02,1.27 180 top
J12  114.3,81.28 270 top
J13  67.42,32.39 180 bottom
J14  8.89,6.35 180 top
J15  24.13,109.22 0 top
J16  3.81,109.22 0 top
J17  39.37,58.42 90 top
J18  5.08,13.97 180 top
J19  54.61,16.51 270 top
J20  81.28,16.51 270 top
J21  43.18,3.81 180 top
J22  15.24,3.81 180 top
K1  100.33,63.5 90 top
LED1  26.67,104.14 180 top
LED2  29.21,104.14 180 top
OK1  25.4,62.23 270 top
OK2  25.4,39.37 270 top
Q1  2N7002  [SOT23']  120.65,101.6 0 top
Q2  2N7002  [SOT23']  113.03,101.6 0 top
Q3  2N7002  [SOT23']  105.41,101.6 0 top
Q4  2N7002  [SOT23']  100.33,52.07 0 top
R1  54.61,102.87 270 top
R2  58.42,102.87 270 top
R3  62.23,102.87 270 top
R4  66.04,102.87 90 top
R5  95.69,52.01 180 top
R6  113.03,53.34 0 top
R7  113.03,50.8 0 top
R8  113.03,48.26 0 top
R9  113.03,45.72 0 top
R10  113.03,43.18 0 top
R11  113.03,40.64 0 top
R12  113.03,38.1 0 top
R13  113.03,35.56 0 top
R14  113.03,33.02 0 top
R15  120.65,97.79 180 top
R16  123.19,101.6 270 top
R17  113.03,97.79 180 top
R18  115.57,101.6 270 top
R19  105.41,97.79 180 top
R20  107.95,101.6 270 top
R21  8.89,93.98 0 top
R22  8.89,99.06 0 top
R23  8.89,101.6 180 top
R24  8.89,96.52 180 top
R25  23.5,76.2 180 top
R26  23.5,25.4 0 top
R27  27.3,76.2 0 top
R28  27.3,25.4 180 top
R29  15.24,104.14 180 top
R30  94.81,55.88 90 top
R31  24.13,104.14 90 top
R32  31.75,104.14 90 top
RN1  39.37,104.14 270 top
S1  86.36,99.06 90 top
S2  93.98,99.06 90 top
SJ1  22.86,11.43 90 top
U$1  62.23,8.89 270 top
U$2  [40MM-FAN]  64.77,60.96 0 top

### Tracks (layer width: path | path; a pad name or v marks a point on that pad's centre or on a via)
+3V3  (via drill 0.5)
  Top 0.305: D3.2 16.25,98.05
  Top 0.508: R27.8 R27.7 R27.6 R27.5 28.79,77.05 v29.84,78.11 | R3.2 v62.23,100.33 | R2.2 v58.42,100.33 | RN1.16 RN1.14 RN1.12 RN1.10 RN1.8 RN1.6 RN1.4 RN1.2 42.17,102.49 v42.55,102.11 | J5.10 77.11,104.16 v77.09,104.14 | D5.2 D3.2 16.19,98.74 v16.51,99.06 | Q3.1 R19.2 v102.87,97.79 | Q2.1 R17.2 v110.49,97.79 | Q1.1 R15.2 v118.11,97.79 | R29.5 R29.6 R29.7 R29.8 17.36,103.29 v17.78,102.87
  pour Route15 (isolate 0.254): 37.85,78.74 37.85,102.87 19.05,102.87 19.05,97.79 13.97,97.79 13.97,105.41 99.06,105.41 99.06,101.6 106.3,101.6 106.3,96.77 109.73,96.77 109.73,101.6 113.67,101.6 113.67,96.77 117.47,96.77 117.47,101.6 119.25,101.6 119.25,91.44 83.82,91.44 83.82,81.28 44.45,81.28 44.45,77.47 30.48,77.47 30.48,74.93 25.4,74.93 25.4,78.74
+3V3_GPIO1  (via drill 0.5)
  Top 0.508: R28.5 R28.6 R28.7 R28.8 29.63,24.55 v29.72,24.64 | IC6.~SLEEP 25.4,14.73 SJ1.2
  pour Route15 (isolate 0.254): 59.56,7.87 59.56,27.43 25.91,27.43 25.91,22.86 19.05,22.86 19.05,11.43 52.07,11.43 52.07,7.87
+5V  (via drill 0.5)
  Top 0.508: R25.1 R25.2 R25.3 R25.4 22.01,77.05 v20.95,78.11 | R26.4 R26.3 R26.2 R26.1 21.04,24.55 v20.95,24.64 | C1.+ 109.73,58.98 107.75,60.96 104.14,60.96 | 104.14,60.96 K1.1 | R21.2 v11.43,93.98 | J2.3 24.13,95.4 R31.1 | D1.C 102.48,59.3 104.14,60.96 | R20.2 v107.95,98.3 | R18.2 v115.57,98.3 | R16.2 v123.19,98.3 | R22.2 v11.43,99.06
  pour Route15 (isolate 0.254): 25.4,92.71 -1.27,92.71 -1.27,114.3 127,114.3 127,68.58 115.57,68.58 115.57,41.91 85.09,41.91 85.09,90.17 120.27,90.17 120.27,102.87 116.59,102.87 116.59,97.41 114.55,97.41 114.55,102.87 108.84,102.87 108.84,97.41 107.06,97.41 107.06,102.87 100.33,102.87 100.33,106.68 12.7,106.68 12.7,96.33 20.32,96.33 20.32,101.6 35.18,101.6 35.18,80.01 24.13,80.01 24.13,31.75 63.5,31.75 63.5,4.57 55.88,4.57 55.88,7.24 60.58,7.24 60.58,28.45 25.4,28.45 25.4,24.13 17.78,24.13 17.78,82.55 30.48,82.55 30.48,99.44 25.4,99.44
+12V  (via drill 0.5)
  Top 0.508: IC4.9 v20.32,89.53 | IC1.9 105.73,37.25 C6.1 v104.14,35.56 | IC2.9 105.94,23.07 C2.1 105.86,22.73 v105.86,20.89 | C3.+ 119.96,16.51 121.92,18.47 J3.18 | J2.2 27.94,96.84 31.75,100.65 R32.1 31.75,100.33 33.34,98.74 C7.1 37.02,98.74 37.97,97.79 C8.+ | J17.2 35.95,64.38 D4.C 35.95,70.09 34.85,71.19 C4.+
  Top 1.016: IC6.VMOT 38.1,7.62 39.93,9.45 C5.+
  pour Route15 (isolate 0.254): 29.97,97.79 26.04,97.79 26.04,91.44 -1.27,91.44 -1.27,-1.27 127,-1.27 127,67.31 116.84,67.31 116.84,40.77 44.45,40.77 44.45,76.2 33.02,76.2 33.02,33.02 66.04,33.02 66.04,34.29 71.12,34.29 71.12,3.56 50.8,3.56 50.8,10.16 16.51,10.16 16.51,83.82 29.97,83.82
A1
  Top 1.016: J11.3 IC6.A1
  Bottom 0.813: 27.94,4.91 25.97,2.95 19.75,2.95 18.88,3.81 J22.1
  Bottom 1.016: IC6.A1 27.94,4.91
A2
  Top 1.016: J11.4 IC6.A2
  Bottom 0.813: IC6.A2 25.4,6.39 24.2,7.59 16,7.59 13.49,5.08 J22.2
ADC_IN0
  Bottom 0.508: J13.1 67.42,34.4 71.12,38.1 83.82,38.1 86.36,40.64 S1.O
ADC_IN1
  Bottom 0.508: J13.2 69.96,33.66 72.5,36.2 88.27,36.2 93.98,41.91 S2.O
B1
  Top 1.016: J11.2 IC6.B1
  Bottom 0.813: 30.48,4.91 32.45,2.95 38.67,2.95 39.54,3.81 J21.2
  Bottom 1.016: 30.48,4.91 IC6.B1
B2
  Top 1.016: J11.1 IC6.B2
  Bottom 0.813: IC6.B2 33.02,6.39 34.23,7.59 42.41,7.59 44.93,5.08 J21.1
DE10_BUZZER
  Bottom 0.305: J1.2 119.38,1.27 80.01,1.27 72.12,9.16 DE1.GPIO_1_10
DE10_DCJACK_5V
  Bottom 1.27: J14.1 8.89,12.66 J18.2
DE10_DCJACK_GND
  Bottom 1.27: J14.3 3.81,10.2 J18.1
DE10_DIS
  Top 0.305: DE1.GPIO_0_31 72.12,85.36 75.17,82.31 83.54,82.31 89.66,76.19 89.66,59.69 92.52,56.83 R30.2
DE10_EMG
  Top 0.305: J5.9 74.61,107.82 70.61,103.82 R4.2 65.02,103.82 64.07,102.87 64.07,98.36 65.68,96.75 65.68,88.1 DE1.GPIO_0_27
DE10_EXT_DOOR_NC
  Top 0.305: R29.3 14.84,105.62 11.31,109.16 J16.4
  Bottom 0.305: DE1.GPIO_0_13 47.9,88.1 46.23,88.1 45.48,88.86 45.48,89.65 29.93,105.2 14.44,105.2 11.31,108.33 J16.4
DE10_EXT_DOOR_NO
  Top 0.305: R29.2 15.62,105.01 15.62,106.62 13.81,108.43 J16.5
  Bottom 0.305: DE1.GPIO_0_14 49.26,89.3 47.55,91.01 45.36,91.01 30.23,106.14 16.07,106.14 13.81,108.4 J16.5
DE10_EXT_EMG
  Top 0.305: R29.1 16.31,105.22 J16.6
  Bottom 0.305: J16.6 16.26,109.17 17.45,109.17 18.4,108.22 29.52,108.22 45.79,91.95 48.26,91.95 50.57,89.64 50.57,87.97 DE1.GPIO_0_15
DE10_EXT_START
  Top 0.305: 9.31,104.99 R29.4 | J16.1 3.81,107.95 6.77,104.99 8.89,104.99 9.31,104.99 | DE1.GPIO_0_9 44.18,86.79 45.49,88.09 45.49,89.64 42.66,92.47 21.59,92.47 19.05,95.01 19.05,100.33 17.78,101.6 12.7,101.6 9.31,104.99
DE10_IN#1
  Top 0.305: R27.4 28.61,74.72 30.13,73.19 30.13,71.12 OK1.16 31.44,71.12 32.71,69.85 32.71,66.17 35.94,62.94 35.94,52.45 54.34,34.05 DE1.GPIO_1_23
DE10_IN#2
  Top 0.305: R27.3 27.7,67.23 28.9,66.04 OK1.14 31.44,66.04 34.98,62.5 34.98,51.41 51.8,34.58 DE1.GPIO_1_25
DE10_IN#3
  Top 0.305: R27.2 26.91,62.95 28.9,60.96 OK1.12 31.44,60.96 33.91,58.49 33.91,50.47 49.26,35.12 DE1.GPIO_1_27
DE10_IN#4
  Top 0.305: R27.1 26,58.77 28.9,55.88 OK1.10 31.44,55.88 32.71,54.61 32.71,49.53 44.18,38.06 DE1.GPIO_1_31
DE10_IN#5
  Top 0.305: R28.4 26,45.37 28.9,48.26 OK2.16 31.44,48.26 41.64,38.06 DE1.GPIO_1_33
DE10_IN#6
  Top 0.305: R28.3 26.91,41.19 28.9,43.18 OK2.14 31.44,43.18 39.1,35.52 DE1.GPIO_1_35
DE10_IN#7
  Top 0.305: R28.2 27.7,36.91 28.9,38.1 OK2.12 31.44,38.1 36.56,32.98 DE1.GPIO_1_37
DE10_IN#8
  Top 0.305: R28.1 28.51,26.34 28.51,32.51 29.02,33.02 OK2.10 31.44,33.02 34.02,30.44 DE1.GPIO_1_39
DE10_IO_1
  Top 0.305: DE1.GPIO_1_20 59.42,22.59 54.61,17.78 J19.1
DE10_IO_2
  Top 0.305: J19.2 58.48,16.51 61.96,19.99 DE1.GPIO_1_18
DE10_IO_3
  Top 0.305: J19.3 53.34,13.97 52.07,15.24 52.07,17.78 56.88,22.59 DE1.GPIO_1_22
DE10_IO_4
  Top 0.305: DE1.GPIO_1_16 64.5,20.05 58.42,13.97 J19.4
DE10_IO_5
  Top 0.305: J19.5 53.34,11.43 50.55,14.22 50.55,18.8 54.34,22.59 DE1.GPIO_1_24
DE10_IO_6
  Top 0.305: J19.6 58.61,11.43 67.04,19.86 DE1.GPIO_1_14
DE10_IO_7
  Top 0.305: J19.7 53.34,8.89 49.15,13.08 49.15,19.83 51.8,22.48 DE1.GPIO_1_26
DE10_KB_CLK
  Top 0.305: DE1.GPIO_0_10 41.93,91.53 19.05,91.53 17.78,92.8 17.78,99.19 16.83,100.14 D3.3 15.21,100.17 11.27,100.17 R23.1
DE10_KB_DATA
  Top 0.305: DE1.GPIO_0_7 41.64,87.61 42.82,88.79 42.82,89.77 42.13,90.46 17.92,90.46 15.24,93.14 D5.3 10.04,96.33 R24.1
DE10_LS_X
  Top 0.305: DE1.GPIO_0_33 74.66,85.39 76.43,83.62 98.86,83.62 109.22,93.98 120.65,93.98 121.6,94.93 R15.1 Q1.2
DE10_LS_Y
  Top 0.305: DE1.GPIO_0_35 77.2,85.45 78.1,84.56 97.26,84.56 107.95,95.25 113.03,95.25 113.98,96.2 R17.1 Q2.2
DE10_LS_Z
  Top 0.305: DE1.GPIO_0_37 79.74,86.66 80.97,85.43 95.47,85.43 106.36,96.33 R19.1 Q3.2
DE10_OUT#1
  Top 0.305: IC4.7 33.01,88.27 DE1.GPIO_0_2
DE10_OUT#2
  Top 0.305: IC4.6 32.61,87 33.53,87.92 35.2,87.92 DE1.GPIO_0_4
DE10_OUT#3
  Top 0.305: IC4.5 33.01,85.72 DE1.GPIO_0_1
DE10_OUT#4
  Top 0.305: IC4.4 34.16,84.45 35.25,85.54 35.25,87.1 36.25,88.1 37.94,88.1 38.61,88.77 38.61,88.79 DE1.GPIO_0_6
DE10_OUT#5
  Top 0.305: IC4.3 34.15,83.19 36.56,85.6 DE1.GPIO_0_3
DE10_OUT#6
  Top 0.305: DE1.GPIO_0_8 40.28,87.92 38.61,87.92 37.92,87.23 37.92,85.54 34.29,81.92 IC4.2
DE10_OUT#7
  Top 0.305: DE1.GPIO_0_5 39.1,85.34 34.4,80.64 IC4.1
DE10_OUT#8
  Top 0.305: DE1.GPIO_1_1 82.28,27.94 85.45,31.11 IC2.3
DE10_POLOLU_DIR
  Top 0.305: DE1.GPIO_1_40 32.7,22.43 22.76,22.43 20.32,19.98 IC6.DIR
DE10_POLOLU_EN
  Top 0.305: IC6.~ENABLE 39.94,17.78 40.88,18.72 44.23,18.72 DE1.GPIO_1_28
DE10_POLOLU_M0
  Top 0.305: IC6.M0 35.56,19.43 36.01,19.88 40.31,19.88 DE1.GPIO_1_32
DE10_POLOLU_M1
  Top 0.305: DE1.GPIO_1_34 38.39,20.5 33.71,20.5 33.02,19.81 IC6.M1
DE10_POLOLU_M2
  Top 0.305: DE1.GPIO_1_36 36.47,21.12 31.41,21.12 30.48,20.19 IC6.M2
DE10_POLOLU_STEP
  Top 0.305: DE1.GPIO_1_38 34.55,21.74 24.62,21.74 22.86,19.98 IC6.STEP
DE10_RUN/TEACH
  Top 0.305: J5.7 69.61,108.08 67.89,106.36 66.12,106.36 63.58,103.82 R3.1 61.09,103.82 60.26,103 60.26,99.11 64.5,94.87 DE1.GPIO_0_26
DE10_RUN_LED
  Top 0.305: J5.3 59.61,107.95 58.82,107.16 55.14,107.16 52.64,104.66 52.64,100.12 61.96,90.8 DE1.GPIO_0_24
DE10_START
  Top 0.305: DE1.GPIO_0_25 63.14,88.1 63.14,92.56 56.64,99.06 56.64,103 57.59,103.95 58.29,103.95 R2.1 58.42,103.95 59.88,103.95 62.42,106.49 63.12,106.49 64.61,107.98 J5.5
DE10_TEACH_P1
  Top 0.305: DE1.GPIO_0_28 67.04,91.17 70.87,95 73.41,95 85.92,107.51 J8.1
DE10_TEACH_P2
  Top 0.305: DE1.GPIO_0_32 72.12,90.8 81.01,99.69 81.01,101.62 86.91,107.52 86.91,109.74 J8.2
DE10_TEACH_P3
  Top 0.305: DE1.GPIO_0_34 74.66,90.8 82.55,98.69 82.55,102.09 87.92,107.46 J8.3
DE10_TEACH_P4
  Top 0.305: DE1.GPIO_0_36 77.2,90.8 83.82,97.42 83.82,102.11 88.91,107.19 88.91,109.74 J8.4
DE10_TEACH_P5
  Top 0.305: DE1.GPIO_0_38 79.74,90.8 85.09,96.15 85.09,102.36 89.92,107.19 J8.5
DE10_TEACH_P6
  Top 0.305: DE1.GPIO_0_40 84.2,89.28 88.9,93.98 88.9,100.33 87.63,101.6 S1.S
DE10_TEACH_P7
  Top 0.305: DE1.GPIO_0_39 85.47,86.74 91.44,92.71 91.44,100.33 92.71,101.6 S2.S
DE10_ULN2003_1
  Top 0.305: DE1.GPIO_1_2 83.68,23.75 89.77,29.84 IC2.4
  Bottom 0.305: J20.1 81.28,19.68 82.28,20.68 DE1.GPIO_1_2
DE10_ULN2003_2
  Top 0.305: IC2.5 91.44,28.57 84.8,21.94 80.52,21.94 79.74,22.72 DE1.GPIO_1_4
  Bottom 0.305: J20.3 79.95,13.97 78.79,15.13 78.79,20.96 79.74,21.91 DE1.GPIO_1_4
DE10_ULN2003_3
  Top 0.305: DE1.GPIO_1_6 77.2,22.72 79.17,20.74 86.27,20.74 92.84,27.3 IC2.6
  Bottom 0.305: J20.5 79.5,11.43 77.2,13.73 DE1.GPIO_1_6
DE10_ULN2003_4
  Top 0.305: DE1.GPIO_1_8 74.66,22.84 77.96,19.55 87.75,19.55 94.23,26.04 IC2.7
  Bottom 0.305: J20.7 78.99,8.89 74.66,13.22 DE1.GPIO_1_8
DE10_WHEEL_L0
  Top 0.305: RN1.1 44.85,104.94 J15.11
  Bottom 0.305: J15.11 49.13,101.24 60.73,89.64 60.73,87.97 DE1.GPIO_0_23
DE10_WHEEL_L1
  Top 0.305: RN1.3 41.37,105.45 42.3,106.38 43.79,106.38 J15.10
  Bottom 0.305: J15.10 46.63,102.07 DE1.GPIO_0_22
DE10_WHEEL_L2
  Top 0.305: RN1.5 40.64,105.01 40.64,105.84 44.02,109.22 J15.9
  Bottom 0.305: J15.9 44.13,103.7 58.18,89.65 58.18,88.86 59.42,87.61 DE1.GPIO_0_21
DE10_WHEEL_L3
  Top 0.305: RN1.7 39.71,105 39.71,105.96 41.63,107.88 J15.8
  Bottom 0.305: J15.8 41.91,108.94 41.91,104.93 56.88,89.96 DE1.GPIO_0_20
DE10_WHEEL_R0
  Top 0.305: RN1.9 38.97,105.9 36.63,108.24 J15.6
  Bottom 0.305: J15.6 55.7,90.15 55.7,88.79 56.88,87.61 DE1.GPIO_0_19
DE10_WHEEL_R1
  Top 0.305: RN1.11 38.17,105.58 36.5,107.25 36.1,107.25 J15.5
  Bottom 0.305: J15.5 48.84,94.51 49.99,94.51 54.34,90.16 DE1.GPIO_0_18
DE10_WHEEL_R2
  Top 0.305: RN1.13 37.37,105.52 36.51,106.38 34.47,106.38 J15.4
  Bottom 0.305: J15.4 47.4,93.45 49.17,93.45 53.11,89.52 53.11,87.97 DE1.GPIO_0_17
DE10_WHEEL_R3
  Top 0.305: RN1.15 34.68,104.94 32.94,106.68 31.67,106.68 J15.3
  Bottom 0.305: J15.3 29.89,109.22 46.35,92.76 48.57,92.76 51.8,89.53 DE1.GPIO_0_16
DE10_X_AWOFF
  Top 0.305: DE1.GPIO_1_7 74.66,29.72 79.87,34.92 93.85,34.92 97.66,38.73 IC1.7
DE10_X_CCW
  Top 0.305: DE1.GPIO_1_5 77.2,29.21 81.64,33.66 IC2.1
DE10_X_CW
  Top 0.305: DE1.GPIO_1_3 79.74,28.58 83.55,32.38 IC2.2
DE10_Y_AWOFF
  Top 0.305: DE1.GPIO_1_15 64.5,32.64 70.34,38.48 91.31,38.48 95.38,42.55 IC1.4
DE10_Y_CCW
  Top 0.305: IC1.5 95.89,41.27 91.95,37.34 77.85,37.34 70.48,29.97 68.96,29.97 67.04,28.05 DE1.GPIO_1_13
DE10_Y_CW
  Top 0.305: DE1.GPIO_1_9 72.12,29.72 78.6,36.2 92.84,36.2 96.65,40.01 IC1.6
DE10_Z_AWOFF
  Top 0.305: IC1.1 93.2,46.35 88.37,41.52 65.76,41.52 56.88,32.64 DE1.GPIO_1_21
DE10_Z_CCW
  Top 0.305: DE1.GPIO_1_19 59.42,32.64 67.23,40.45 89.18,40.45 93.81,45.09 IC1.2
DE10_Z_CW
  Top 0.305: DE1.GPIO_1_17 61.96,32.64 68.83,39.51 90.25,39.51 94.55,43.81 IC1.3
DIS+
  Top 0.508: J4.3 118.85,86.44 116.06,83.65 106.62,83.65 104.66,81.7 97.27,81.7 K1.P
DIS-
  Top 0.508: J4.1 121.75,91.61 111.17,91.61 K1.S
DIS_DRAIN
  Top 0.508: Q4.3 100.33,54.61 99.06,55.88 D1.A 97.55,55.88 96.52,56.91 K1.2
DIS_GATE
  Top 0.508: R5.2 94.81,52.07 R30.1 96.48,54.93 99.33,52.09 99.33,51.02 Q4.1
GND  (via drill 0.5)
  Top 0.305: D3.1 14.29,97.83
  Top 0.508: C5.- v44.45,13.46 | C3.- v107.95,16.51 | C2.2 v110.49,22.86 | C6.2 v109.22,35.56 | v31.75,63.5 OK1.13 | OK1.9 v31.75,53.34 | OK2.15 v31.75,45.72 | OK1.11 v31.75,58.42 | OK1.15 v31.75,68.58 | OK2.13 v31.75,40.64 | OK2.11 v31.75,35.56 | OK2.9 v31.75,30.48 | C1.- v111.76,68.58 | IC4.8 v31.75,89.53 | D4.A v41.91,67.31 | C4.- v38.1,74.93 | R4.1 v66.04,100.33 | R1.2 v54.61,100.33 | D5.1 14.1,93.98 v12.7,93.98 | v13.97,96.98 14.22,97.23 14.22,97.92 D3.1 | v97.79,24.13 98.42,24.77 IC2.8 | v97.79,36.83 98.42,37.47 IC1.8 | v26.67,100.71 LED1.C LED2.C | R5.1 96.64,49.91 97.79,48.77 v98.93,48.77 v98.94,48.77 100.29,48.77 101.28,49.76 Q4.2 | C8.- 43.98,97.79 v42.95,98.83 | C7.2 32.13,96.84 31.88,96.58 31.88,95.27 J2.1
  pour Route2 (isolate 0.254): -1.27,114.3 127,114.3 127,-1.27 -1.27,-1.27
IN#1_A
  Top 0.305: R25.5 22.2,74.72 20.67,73.19 20.67,71.12 OK1.1
IN#1_K  (via drill 0.5)
  Top 0.305: OK1.2 v19.05,68.58
  Bottom 0.305: v19.05,68.58 17.02,70.61 17.02,77.09 7.75,86.36 J9.2
IN#2_A
  Top 0.305: R25.6 23.09,67.23 21.9,66.04 OK1.3
IN#2_K  (via drill 0.5)
  Top 0.305: OK1.4 v19.05,63.5
  Bottom 0.305: v19.05,63.5 15.76,66.79 15.76,76.06 8,83.82 J9.4
IN#3_A
  Top 0.305: R25.7 23.89,62.95 21.9,60.96 OK1.5
IN#3_K  (via drill 0.5)
  Top 0.305: OK1.6 v19.05,58.42
  Bottom 0.305: v19.05,58.42 14.38,63.09 14.38,75.03 8.13,81.28 J9.6
IN#4_A
  Top 0.305: R25.8 24.8,58.77 21.9,55.88 OK1.7
IN#4_K  (via drill 0.5)
  Top 0.305: OK1.8 v19.05,53.34
  Bottom 0.305: v19.05,53.34 13.12,59.27 13.12,73.62 8,78.74 J9.8
IN#5_A
  Top 0.305: R26.5 24.8,45.37 21.9,48.26 OK2.1
IN#5_K  (via drill 0.5)
  Top 0.305: OK2.2 v19.05,45.72
  Bottom 0.305: v19.05,45.72 11.61,53.16 11.61,72.59 8,76.2 J9.10
IN#6_A
  Top 0.305: R26.6 23.89,41.19 21.9,43.18 OK2.3
IN#6_K  (via drill 0.5)
  Top 0.305: OK2.4 v19.05,40.64
  Bottom 0.305: v19.05,40.64 10.04,49.65 10.04,71.62 8,73.66 J9.12
IN#7_A
  Top 0.305: R26.7 23.09,36.91 21.9,38.1 OK2.5
IN#7_K
  Top 0.305: OK2.6 19.05,35.56 16.31,38.3 16.31,65.3 10.49,71.12 J9.14
IN#8_A
  Top 0.305: R26.8 22.29,26.34 22.29,32.51 21.78,33.02 OK2.7
IN#8_K
  Top 0.305: OK2.8 19.36,30.48 14.27,35.57 14.27,64.39 10.08,68.58 J9.16
LS_X
  Top 0.305: J6.9 122.87,107.12 120.65,104.9 Q1.3 123.04,102.7 R16.1
LS_Y
  Top 0.305: J6.6 115.37,107.06 113.03,104.72 Q2.3 115.42,102.7 R18.1
LS_Z
  Top 0.305: J6.3 107.87,107 105.41,104.54 Q3.3 107.8,102.7 R20.1
MOT_X_AWOFF
  Top 0.305: IC1.10 110.56,38.73 111.19,38.1 R12.1
MOT_X_CCW
  Top 0.305: R13.1 111.06,35.56 109.16,33.66 IC2.16
MOT_X_CW
  Top 0.305: R14.1 110.94,33.02 110.3,32.38 IC2.15
MOT_Y_AWOFF
  Top 0.305: R9.1 111.44,45.72 108.27,42.55 IC1.13
MOT_Y_CCW
  Top 0.305: R10.1 111.32,43.18 109.41,41.27 IC1.12
MOT_Y_CW
  Top 0.305: R11.1 111.19,40.64 110.56,40.01 IC1.11
MOT_Z_AWOFF
  Top 0.305: IC1.16 107.31,46.35 108.28,47.32 108.28,50.75 110.87,53.34 R6.1
MOT_Z_CCW
  Top 0.305: R7.1 110.87,50.8 108.97,48.9 108.97,46.86 107.19,45.09 IC1.15
MOT_Z_CW
  Top 0.305: R8.1 111,48.26 109.91,47.16 109.91,46.05 107.7,43.84 105.97,43.84 IC1.14
N$1
  Top 0.508: R31.2 24.23,105.19 LED1.A
N$2
  Top 0.508: LED2.A 31.65,105.19 R32.2
OTG_D+
  Top 0.305: J10.D+ 118.83,75.2 118.61,74.98 115.52,74.98 J12.5
OTG_D-
  Top 0.305: J10.D- 118.83,77.2 118.61,77.42 116.33,77.42 115.62,77.42 J12.3
OTG_GND
  Top 0.305: J10.USB_GND 118.87,72.7 118.61,72.44 115.52,72.44 J12.7
OTG_VBUS
  Top 0.305: J10.VBUS 118.87,79.7 118.61,79.96 116.33,79.96 115.62,79.96 J12.1
OUT#1
  Top 0.305: IC4.10 18.73,88.27 15.65,91.34 7.26,91.34 3.81,87.88 J9.1
OUT#2
  Top 0.305: IC4.11 19.49,87 16.16,83.67 11.78,83.67 10.34,85.1 5.09,85.1 J9.3
OUT#3
  Top 0.305: IC4.12 19.84,85.72 16.66,82.54 5.07,82.54 J9.5
OUT#4
  Top 0.305: IC4.13 19.95,84.45 15.49,80 5.07,80 J9.7
OUT#5
  Top 0.305: IC4.14 20.24,83.19 14.51,77.46 5.07,77.46 J9.9
OUT#6
  Top 0.305: IC4.15 20.53,81.92 13.54,74.92 5.07,74.92 J9.11
OUT#7
  Top 0.305: J9.13 5.07,72.38 12.76,72.38 21.03,80.64 IC4.16
OUT#8  (via drill 0.5)
  Top 0.305: v103.76,31.11 IC2.14
  Bottom 0.305: J9.15 5.09,67.3 6.92,67.3 8.38,65.83 8.38,46.95 26.19,29.15 101.79,29.15 v103.76,31.11
PS2_KB_CLK
  Top 0.254: R22.1 7.83,99.17 6.7,99.17 3.81,102.06 J7.P$5
  Top 0.305: R22.1 R23.2
PS2_KB_DATA
  Top 0.254: J7.P$1 3.81,92.79 6.75,92.79 R21.1 R24.2
RUN_LED_RES
  Top 0.305: J5.4 62.11,108.08 60.43,106.4 58.57,106.4 55.99,103.82 R1.1
STEPPER_FAULT
  Top 0.305: SJ1.1 IC6.~FAULT
SW_TEACH_P6
  Bottom 0.305: J8.6 89.92,110.64 90.91,109.65 90.91,102.34 87.63,99.06 S1.P
SW_TEACH_P7
  Bottom 0.305: S2.P 92.71,99.06 91.92,99.85 J8.7
ULN2003_1
  Top 0.305: IC2.13 103.89,29.84 102.36,28.32 102.36,22.86 96.01,16.51 J20.2
ULN2003_2
  Top 0.305: IC2.12 104.27,28.57 102.92,27.23 102.92,21.48 95.42,13.97 J20.4
ULN2003_3
  Top 0.305: IC2.11 104.33,27.3 103.61,26.58 103.61,20.28 94.76,11.43 J20.6
ULN2003_4
  Top 0.305: IC2.10 104.58,26.04 104.29,25.74 104.29,18.7 94.48,8.89 J20.8
X_AWOFF_NEG
  Top 0.305: R12.2 115.54,38.1 118.87,34.77 J3.13
X_CCW_NEG
  Top 0.305: R13.2 115.05,35.56 120.84,29.77 J3.15
X_CW_NEG
  Top 0.305: R14.2 115.38,33.02 118.11,30.29 118.11,27.31 120.65,24.77 J3.17
Y_AWOFF_NEG
  Top 0.305: J3.7 119.63,49.77 115.58,45.72 R9.2
Y_CCW_NEG
  Top 0.305: J3.9 117.09,44.77 115.5,43.18 R10.2
Y_CW_NEG
  Top 0.305: R11.2 117.24,40.64 118.11,39.77 J3.11
Z_AWOFF_NEG
  Top 0.305: J3.1 121.92,63.68 117.11,58.87 117.11,55.2 115.25,53.34 R6.2
Z_CCW_NEG
  Top 0.305: J3.3 121.92,58.97 118.85,55.89 118.85,54.14 115.5,50.8 R7.2
Z_CW_NEG
  Top 0.305: J3.5 121.92,54.64 115.54,48.26 R8.2

### Text on the board
tPlace: LED | START | TEACH | EMG | 5 | G | Z | 5 | G | Y | 5 | G | X | 5 | 12 | G | DIG | ADC | DIS | GPIO_0 | + - | AW.OFF | + | FAN | Z | + - | CCW | - | + - | CW | AW.OFF | + - | Y | + - | CCW | + - | CW | DE10-Nano : F7300N Control Board | + - | AW.OFF | X | GPIO_1 | + - | CCW | + - | CW | MOTOR | + | - | 3.3 | Buzzer | G | 5 | 5 | G | 12 | +
bPlace: EXT Conn | Program Number | Panel I/O | LIMIT SWITCH | Teach Pendant | PS/2 | Rear I/O